# EAGLE design couch-int-rc (EAGLE 7.6.0)

## Sheet 1 of 4
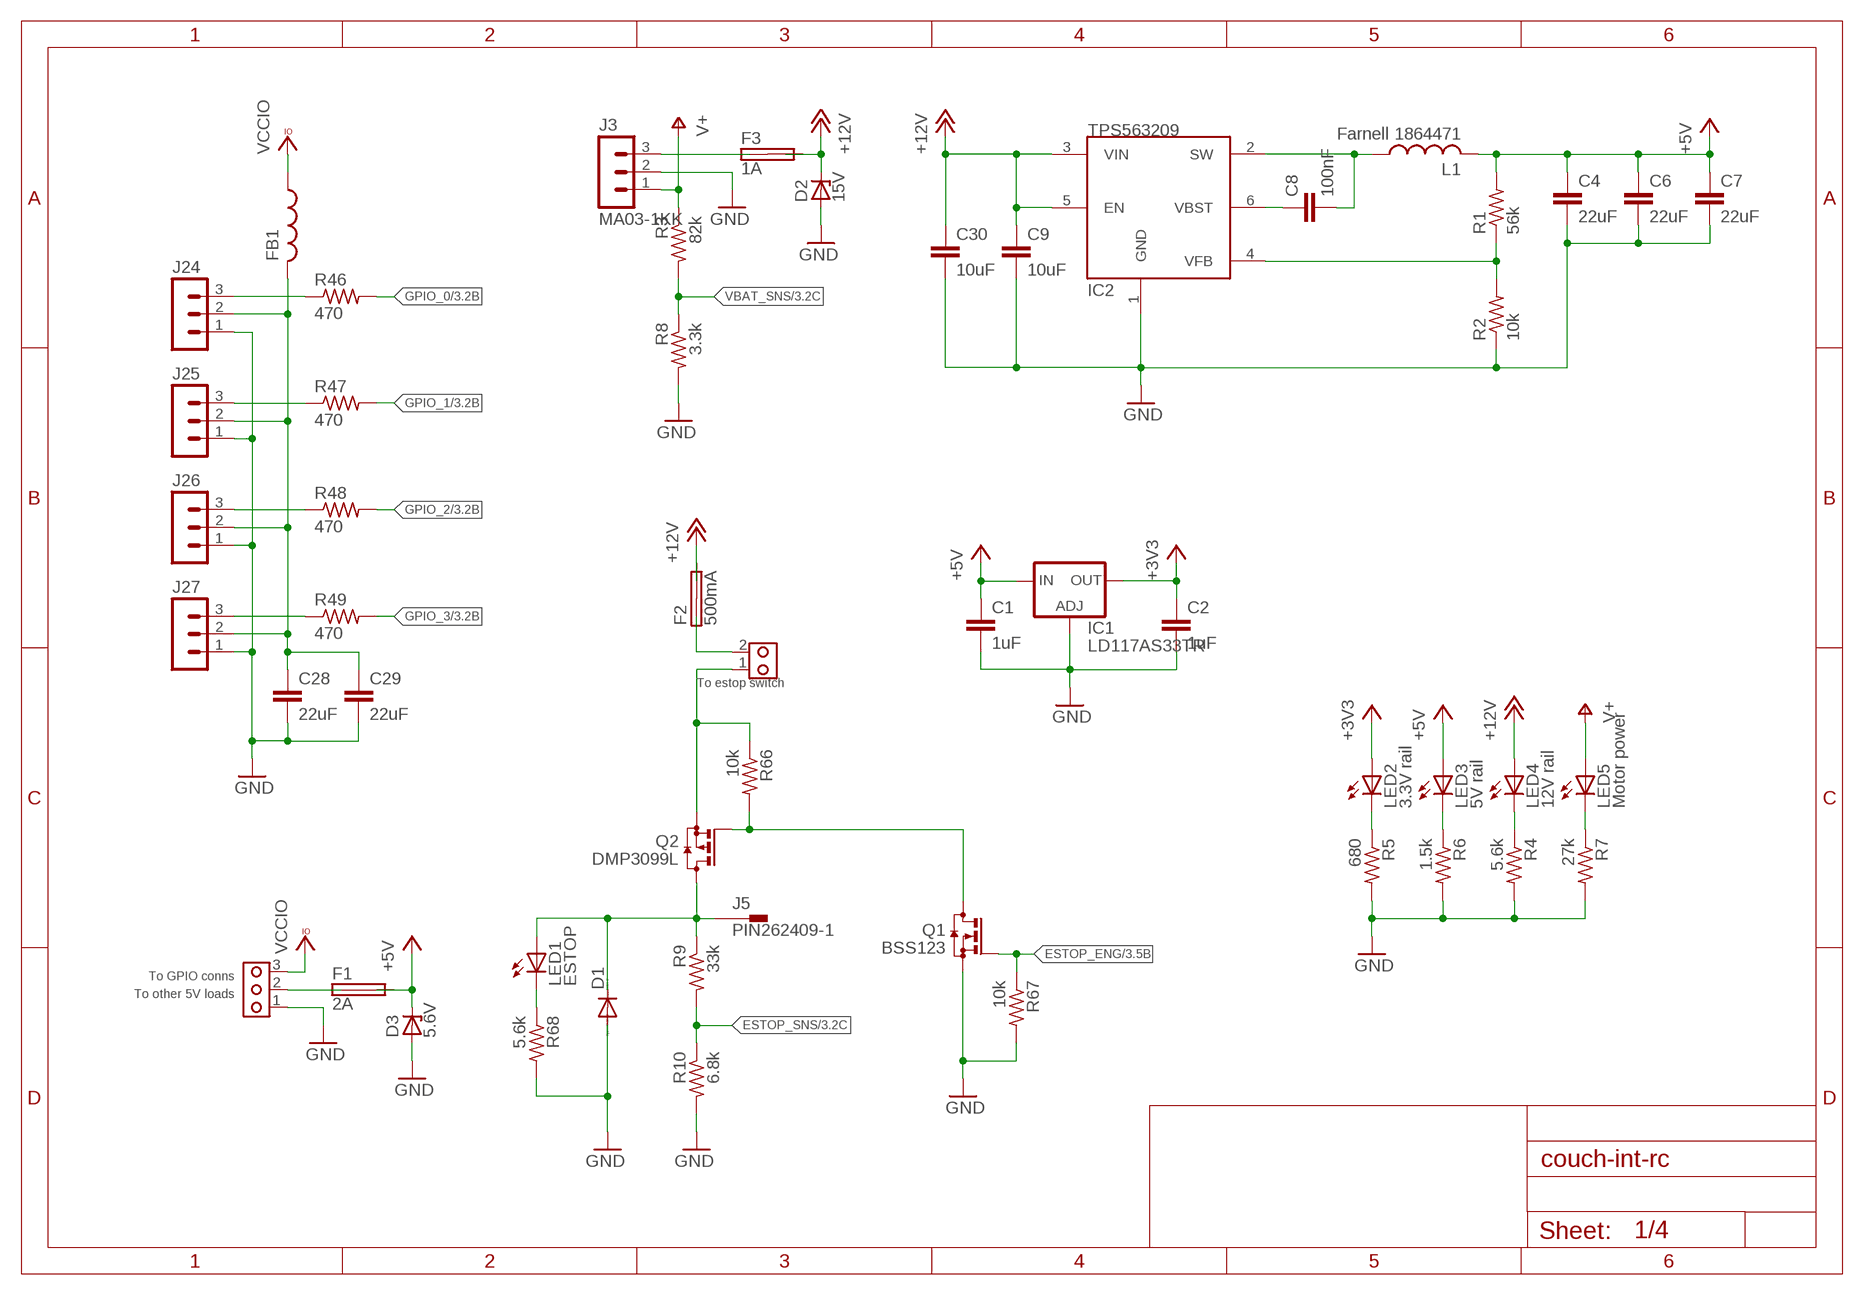
[diagram p0: schematic, sheet 1]

### Parts
C1  1uF  C-EUC0603  [C0603]
C2  1uF  C-EUC0603  [C0603]
C4  22uF  C-EUC1206  [C1206]
C6  22uF  C-EUC1206  [C1206]
C7  22uF  C-EUC1206  [C1206]
C8  100nF  C-EUC0603  [C0603]
C9  10uF  C-EUC1206  [C1206]
C28  22uF  C-EUC1206  [C1206]
C29  22uF  C-EUC1206  [C1206]
C30  10uF  C-EUC1206  [C1206]
D1  DIODE-SMB  [SMB]
D2  15V  ZENER-DIODESOD80C  [SOD80C]
D3  5.6V  ZENER-DIODESOD80C  [SOD80C]
F1  2A  FUSESHK20L  [SHK20L]
F2  500mA  SHK20L  [SHK20L]
F3  1A  SHK20L  [SHK20L]
FB1  L-USL3216C  [L3216C]
IC1  LD117AS33TR  [SOT223]
IC2  TPS563209  [SOT23-6]
J1  PCBTERM3  [PCBTERM3]
J3  MA03-1KK  [MOLEX-3]
J4  PCBTERM2  [PCBTERM]
J5  PIN262409-1  [62409-1]
J24  MA03-1  [MA03-1]
J25  MA03-1  [MA03-1]
J26  MA03-1  [MA03-1]
J27  MA03-1  [MA03-1]
L1  Farnell 1864471  L_USMCSDRH73B  [MCSDRH73B]
LED1  ESTOP  LEDCHIPLED_0603  [CHIPLED_0603]
LED2  3.3V rail  LEDCHIPLED_0603  [CHIPLED_0603]
LED3  5V rail  LEDCHIPLED_0603  [CHIPLED_0603]
LED4  12V rail  LEDCHIPLED_0603  [CHIPLED_0603]
LED5  Motor power  LEDCHIPLED_0603  [CHIPLED_0603]
Q1  BSS123  [SOT23]
Q2  DMP3099L  BSS84  [SOT23]
R1  56k  R-US_R0603  [R0603]
R2  10k  R-US_R0603  [R0603]
R3  82k  R-US_R0603  [R0603]
R4  5.6k  R-US_R0603  [R0603]
R5  680  R-US_R0603  [R0603]
R6  1.5k  R-US_R0603  [R0603]
R7  27k  R-US_R0603  [R0603]
R8  3.3k  R-US_R0603  [R0603]
R9  33k  R-US_R0603  [R0603]
R10  6.8k  R-US_R0603  [R0603]
R46  470  R-US_R0603  [R0603]
R47  470  R-US_R0603  [R0603]
R48  470  R-US_R0603  [R0603]
R49  470  R-US_R0603  [R0603]
R66  10k  R-US_R0603  [R0603]
R67  10k  R-US_R0603  [R0603]
R68  5.6k  R-US_R0603  [R0603]

### Nets
12V_ESTOP: D1.C J5.A1 J5.A2 LED1.A Q2.3(D) R9.1
+3V3: C2.1 IC1.4(OUT) LED2.A ; also sheet 2,3,4
+5V: C1.1 C4.1 C6.1 C7.1 D3.C F1.2A F1.2B IC1.3(IN) L1.P$2 LED3.A R1.2 ; also sheet 4
+12V: C9.1 C30.1 D2.C F2.2A F2.2B F3.2A F3.2B IC2.3(VIN) IC2.5(EN) LED4.A
ESTOP_ENG: Q1.1(G) R67.1 ; also sheet 3
ESTOP_SNS: R9.2 R10.1 ; also sheet 3
GND: C1.2 C2.2 C4.2 C6.2 C7.2 C9.2 C28.2 C29.2 C30.2 D1.A D2.A D3.A IC1.1(ADJ) IC2.1(GND) J1.1 J3.2 J24.1 J25.1 J26.1 J27.1 Q1.2(S) R2.1 R4.2 R5.2 R6.2 R7.2 R8.2 R10.2 R67.2 R68.2 ; also sheet 2,3,4
GPIO_0: R46.2 ; also sheet 3
GPIO_1: R47.2 ; also sheet 3
GPIO_2: R48.2 ; also sheet 3
GPIO_3: R49.2 ; also sheet 3
N$2: IC2.4(VFB) R1.1 R2.2
N$3: C8.2 IC2.2(SW) L1.P$1
N$4: F1.1A F1.1B J1.2
N$5: C8.1 IC2.6(VBST)
N$6: LED2.C R5.1
N$7: LED3.C R6.1
N$8: LED4.C R4.1
N$9: LED5.C R7.1
N$13: F3.1A F3.1B J3.3
N$45: F2.1A F2.1B J4.2
N$72: Q1.3(D) Q2.1(G) R66.2
N$73: C28.1 C29.1 FB1.2 J24.2 J25.2 J26.2 J27.2
N$74: J4.1 Q2.2(S) R66.1
N$75: LED1.C R68.1
N$76: J27.3 R49.1
N$77: J26.3 R48.1
N$78: J25.3 R47.1
N$79: J24.3 R46.1
V+: J3.1 LED5.A R3.1
VBAT_SNS: R3.2 R8.1 ; also sheet 3
VCCIO: FB1.1 J1.3

### Notes on the sheet
- To estop switch
- To GPIO conns
- To other 5V loads

## Sheet 2 of 4
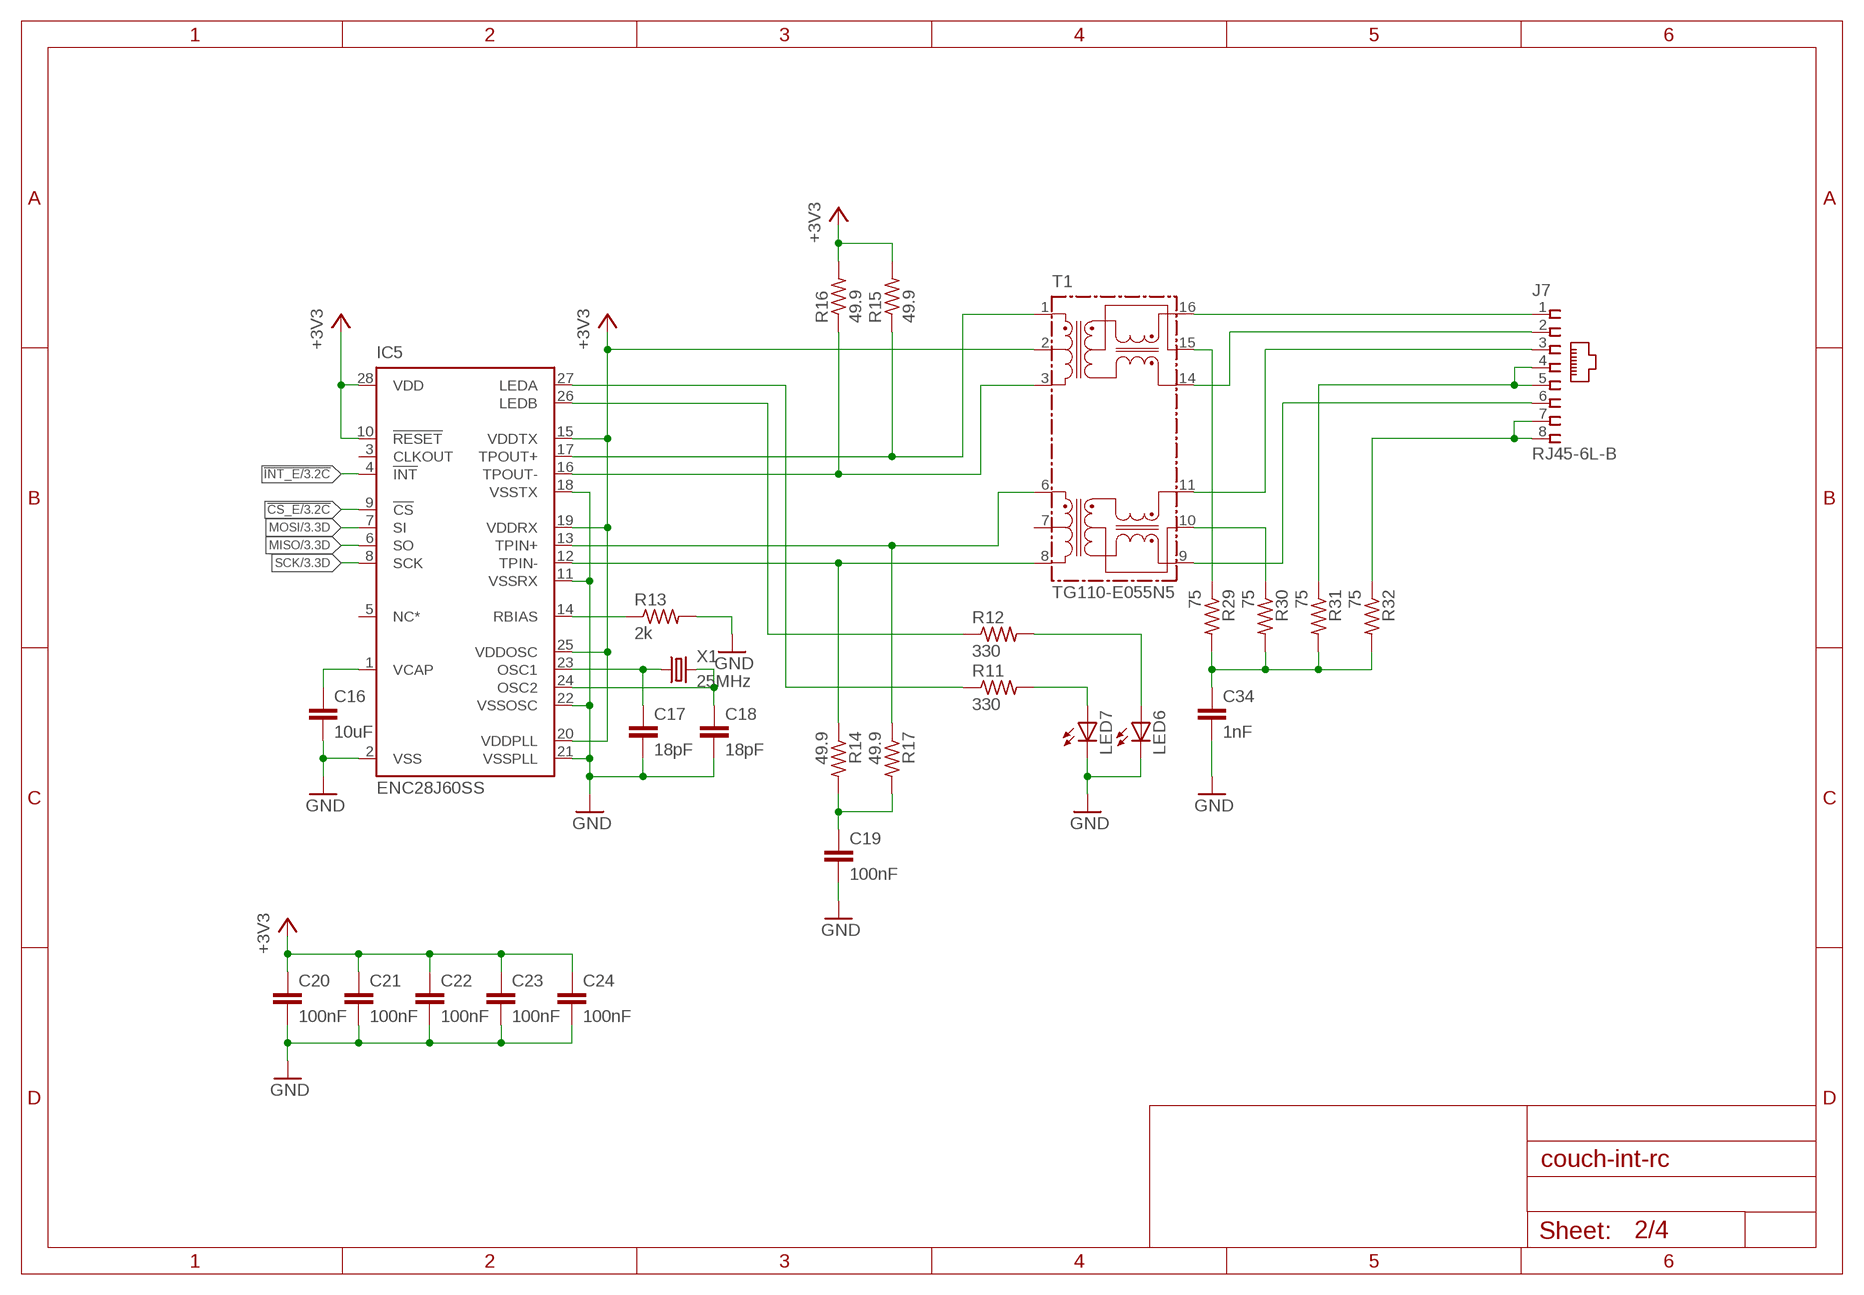
[diagram p1: schematic, sheet 2]

### Parts
C16  10uF  C-EUC0603  [C0603]
C17  18pF  C-EUC0603  [C0603]
C18  18pF  C-EUC0603  [C0603]
C19  100nF  C-EUC0603  [C0603]
C20  100nF  C-EUC0603  [C0603]
C21  100nF  C-EUC0603  [C0603]
C22  100nF  C-EUC0603  [C0603]
C23  100nF  C-EUC0603  [C0603]
C24  100nF  C-EUC0603  [C0603]
C34  1nF  C-EUC0603  [C0603]
IC5  ENC28J60SS  [SSOP-28]
J7  RJ45-6L-B  [RJ45-NO-SHIELD]
LED6  LEDCHIP-LED0603  [CHIP-LED0603]
LED7  LEDCHIP-LED0603  [CHIP-LED0603]
R11  330  R-US_R0603  [R0603]
R12  330  R-US_R0603  [R0603]
R13  2k  R-US_R0603  [R0603]
R14  49.9  R-US_R0603  [R0603]
R15  49.9  R-US_R0603  [R0603]
R16  49.9  R-US_R0603  [R0603]
R17  49.9  R-US_R0603  [R0603]
R29  75  R-US_R0603  [R0603]
R30  75  R-US_R0603  [R0603]
R31  75  R-US_R0603  [R0603]
R32  75  R-US_R0603  [R0603]
T1  TG110-E055N5  [N5]
X1  25MHz  CRYSTALHC49S  [HC49/S]

### Nets
!CS_E: IC5.9(!CS) ; also sheet 3
!INT_E: IC5.4(!INT) ; also sheet 3
+3V3: C20.1 C21.1 C22.1 C23.1 C24.1 IC5.10(!RESET) IC5.15(VDDTX) IC5.19(VDDRX) IC5.20(VDDPLL) IC5.25(VDDOSC) IC5.28(VDD) R15.2 R16.2 T1.2 ; also sheet 1,3,4
GND: C16.2 C17.2 C18.2 C19.2 C20.2 C21.2 C22.2 C23.2 C24.2 C34.2 IC5.2(VSS) IC5.11(VSSRX) IC5.18(VSSTX) IC5.21(VSSPLL) IC5.22(VSSOSC) LED6.C LED7.C R13.2 ; also sheet 1,3,4
MISO: IC5.6(SO) ; also sheet 3
MOSI: IC5.7(SI) ; also sheet 3
N$11: LED6.A R12.2
N$14: IC5.17(TPOUT+) R15.1 T1.1
N$15: IC5.16(TPOUT-) R16.1 T1.3
N$16: IC5.13(TPIN+) R17.1 T1.6
N$17: IC5.12(TPIN-) R14.1 T1.8
N$18: C16.1 IC5.1(VCAP)
N$19: IC5.27(LEDA) R11.1
N$20: IC5.26(LEDB) R12.1
N$21: J7.1 T1.16
N$22: J7.4 J7.5 R31.1
N$23: C18.1 IC5.24(OSC2) X1.2
N$24: C17.1 IC5.23(OSC1) X1.1
N$25: IC5.14(RBIAS) R13.1
N$28: LED7.A R11.2
N$29: J7.7 J7.8 R32.1
N$33: C19.1 R14.2 R17.2
N$34: J7.2 T1.14
N$35: J7.3 T1.11
N$36: J7.6 T1.9
N$38: R29.1 T1.15
N$39: C34.1 R29.2 R30.2 R31.2 R32.2
N$56: R30.1 T1.10
SCK: IC5.8(SCK) ; also sheet 3
Unconnected: IC5.3(CLKOUT) IC5.5(NC*) T1.7

## Sheet 3 of 4
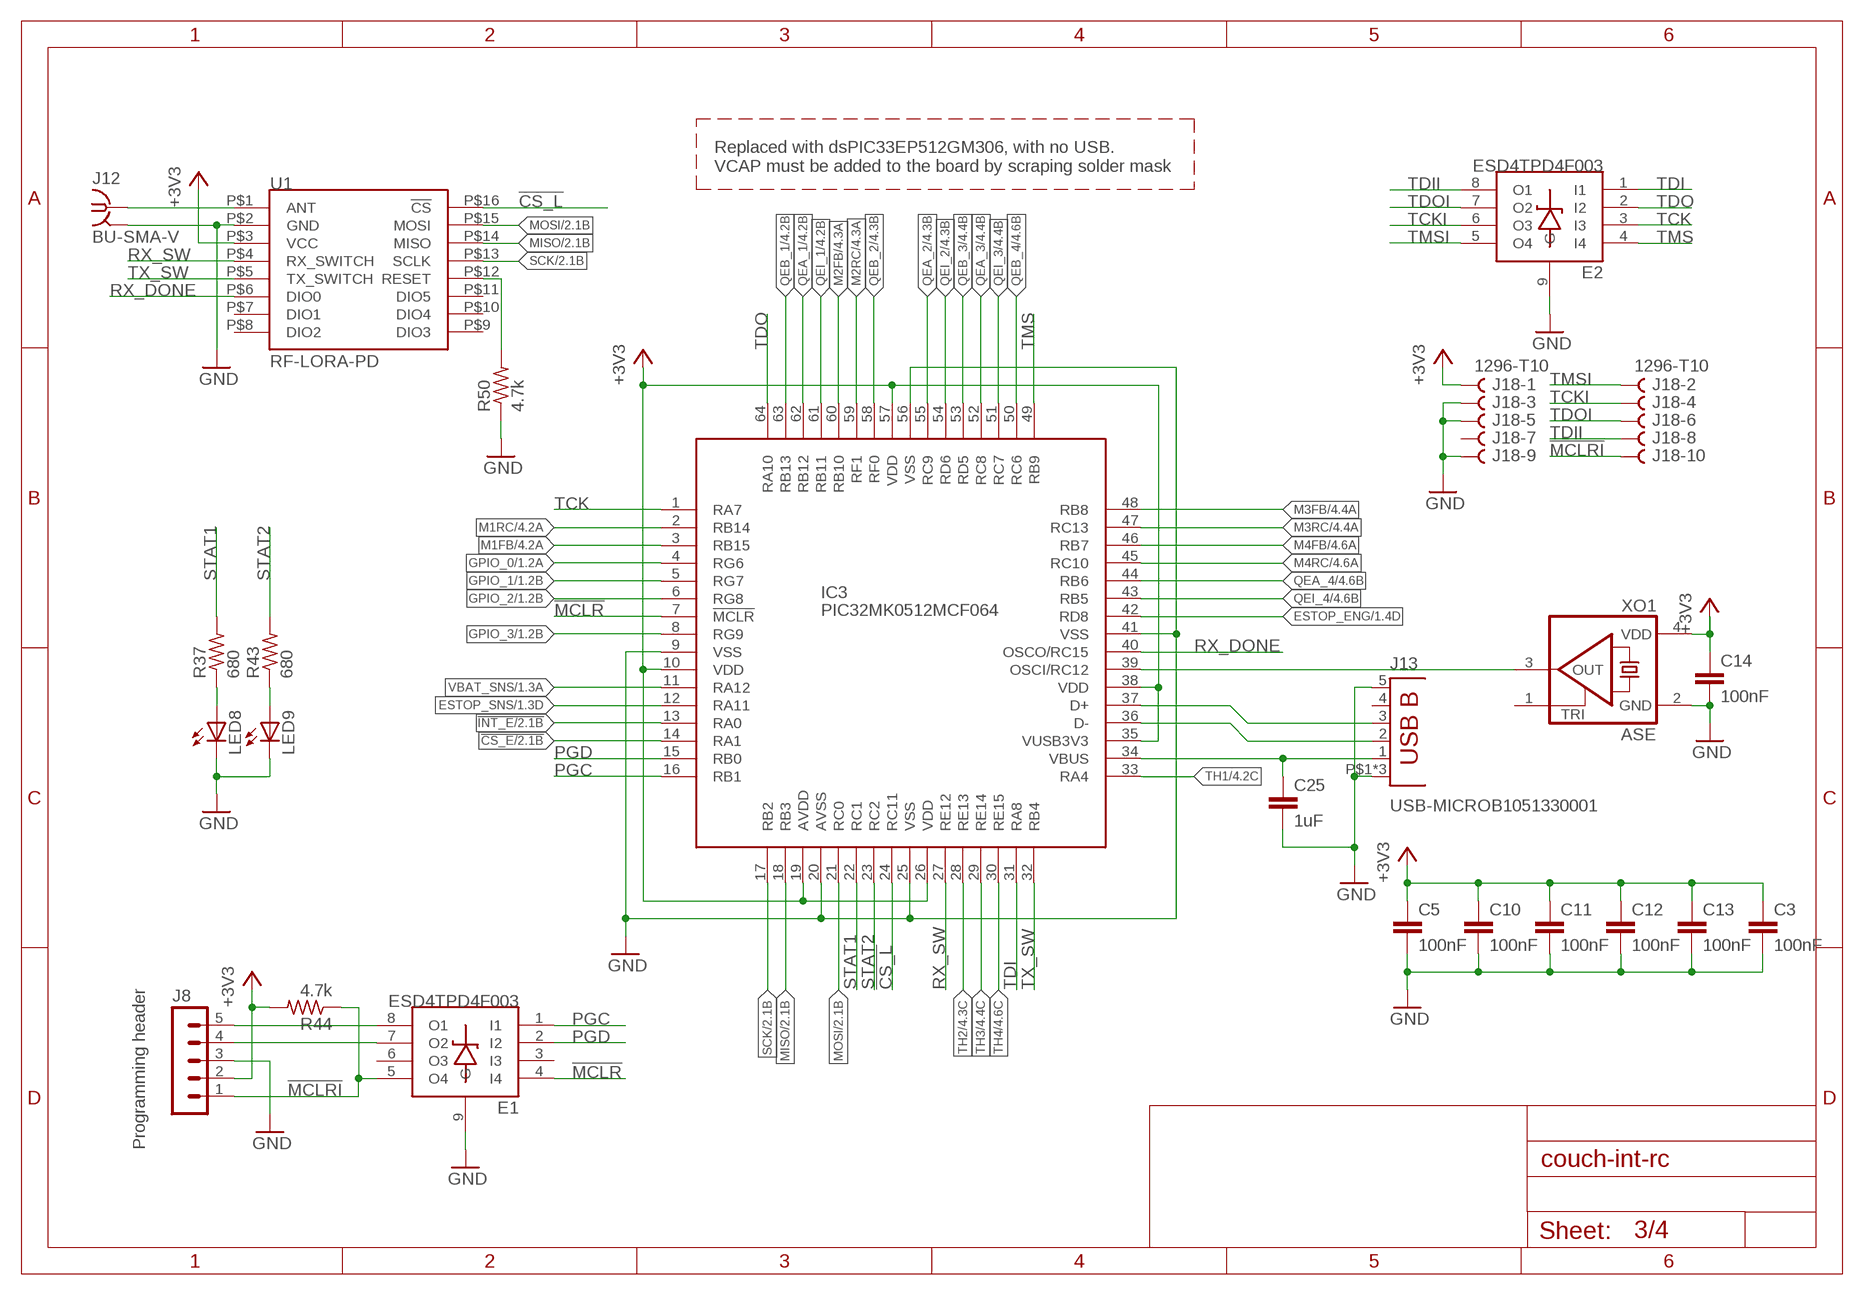
[diagram p2: schematic, sheet 3]

### Parts
C3  100nF  C-EUC0603  [C0603]
C5  100nF  C-EUC0603  [C0603]
C10  100nF  C-EUC0603  [C0603]
C11  100nF  C-EUC0603  [C0603]
C12  100nF  C-EUC0603  [C0603]
C13  100nF  C-EUC0603  [C0603]
C14  100nF  C-EUC0603  [C0603]
C25  1uF  C-EUC0603  [C0603]
E1  ESD4TPD4F003  [WSON-8]
E2  ESD4TPD4F003  [WSON-8]
IC3  PIC32MK0512MCF064  [TQFP-64-10]
J8  MA05-1  [MA05-1]
J12  BU-SMA-V  [BU-SMA-V]
J13  USB-MICROB1051330001  [1051330001]
J18  1296-T10  [1296-10]
LED8  LEDCHIP-LED0603  [CHIP-LED0603]
LED9  LEDCHIP-LED0603  [CHIP-LED0603]
R37  680  R-US_R0603  [R0603]
R43  680  R-US_R0603  [R0603]
R44  4.7k  R-US_R0603  [R0603]
R50  4.7k  R-US_R0603  [R0603]
U1  RF-LORA-PD  [RF-LORA-DIP]
XO1  ASE  [ASE]

### Nets
!CS_E: IC3.14(RA1) ; also sheet 2
!CS_L: IC3.24(RC11) U1.P$16(!CS)
!INT_E: IC3.13(RA0) ; also sheet 2
!MCLR: E1.4(I4) IC3.7(!MCLR)
!MCLRI: E1.5(O4) J8.1 J18.10 R44.1
+3V3: C3.1 C5.1 C10.1 C11.1 C12.1 C13.1 C14.1 IC3.10(VDD) IC3.19(AVDD) IC3.26(VDD) IC3.35(VUSB3V3) IC3.38(VDD) IC3.57(VDD) J8.2 J18.1 R44.2 U1.P$3(VCC) XO1.4(VDD) ; also sheet 1,2,4
ESTOP_ENG: IC3.42(RD8) ; also sheet 1
ESTOP_SNS: IC3.12(RA11) ; also sheet 1
GND: C3.2 C5.2 C10.2 C11.2 C12.2 C13.2 C14.2 C25.2 E1.9(G) E2.9(G) IC3.9(VSS) IC3.20(AVSS) IC3.25(VSS) IC3.41(VSS) IC3.56(VSS) J8.3 J12.2 J12.3 J12.4 J12.5 J13.5(GND) J13.P$1(SHIELD) J13.P$2(SHIELD) J13.P$3(SHIELD) J18.3 J18.5 J18.9 LED8.C LED9.C R50.1 U1.P$2(GND) XO1.2(GND) ; also sheet 1,2,4
GPIO_0: IC3.4(RG6) ; also sheet 1
GPIO_1: IC3.5(RG7) ; also sheet 1
GPIO_2: IC3.6(RG8) ; also sheet 1
GPIO_3: IC3.8(RG9) ; also sheet 1
M1FB: IC3.3(RB15) ; also sheet 4
M1RC: IC3.2(RB14) ; also sheet 4
M2FB: IC3.60(RB10) ; also sheet 4
M2RC: IC3.59(RF1) ; also sheet 4
M3FB: IC3.48(RB8) ; also sheet 4
M3RC: IC3.47(RC13) ; also sheet 4
M4FB: IC3.46(RB7) ; also sheet 4
M4RC: IC3.45(RC10) ; also sheet 4
MISO: IC3.18(RB3) U1.P$14(MISO) ; also sheet 2
MOSI: IC3.21(RC0) U1.P$15(MOSI) ; also sheet 2
N$43: IC3.39(OSCI/RC12) XO1.3(OUT)
N$46: E1.8(O1) J8.5
N$47: E1.7(O2) J8.4
N$48: C25.1 IC3.34(VBUS) J13.1(VBUS)
N$49: IC3.36(D-) J13.2(D-)
N$50: IC3.37(D+) J13.3(D+)
N$66: J12.1 U1.P$1(ANT)
N$67: R50.2 U1.P$12(RESET)
N$69: LED8.A R37.1
N$70: LED9.A R43.1
PGC: E1.1(I1) IC3.16(RB1)
PGD: E1.2(I2) IC3.15(RB0)
QEA_1: IC3.62(RB12) ; also sheet 4
QEA_2: IC3.55(RC9) ; also sheet 4
QEA_3: IC3.52(RC8) ; also sheet 4
QEA_4: IC3.44(RB6) ; also sheet 4
QEB_1: IC3.63(RB13) ; also sheet 4
QEB_2: IC3.58(RF0) ; also sheet 4
QEB_3: IC3.53(RD5) ; also sheet 4
QEB_4: IC3.50(RC6) ; also sheet 4
QEI_1: IC3.61(RB11) ; also sheet 4
QEI_2: IC3.54(RD6) ; also sheet 4
QEI_3: IC3.51(RC7) ; also sheet 4
QEI_4: IC3.43(RB5) ; also sheet 4
RX_DONE: IC3.40(OSCO/RC15) U1.P$6(DIO0)
RX_SW: IC3.27(RE12) U1.P$4(RX_SWITCH)
SCK: IC3.17(RB2) U1.P$13(SCLK) ; also sheet 2
STAT1: IC3.22(RC1) R37.2
STAT2: IC3.23(RC2) R43.2
TCK: E2.3(I3) IC3.1(RA7)
TCKI: E2.6(O3) J18.4
TDI: E2.1(I1) IC3.31(RA8)
TDII: E2.8(O1) J18.8
TDO: E2.2(I2) IC3.64(RA10)
TDOI: E2.7(O2) J18.6
TH1: IC3.33(RA4) ; also sheet 4
TH2: IC3.28(RE13) ; also sheet 4
TH3: IC3.29(RE14) ; also sheet 4
TH4: IC3.30(RE15) ; also sheet 4
TMS: E2.4(I4) IC3.49(RB9)
TMSI: E2.5(O4) J18.2
TX_SW: IC3.32(RB4) U1.P$5(TX_SWITCH)
VBAT_SNS: IC3.11(RA12) ; also sheet 1
Unconnected: E1.3(I3) E1.6(O3) J13.4(USBID) J18.7 U1.P$7(DIO1) U1.P$8(DIO2) U1.P$9(DIO3) U1.P$10(DIO4) U1.P$11(DIO5) XO1.1(TRI)

### Notes on the sheet
- Replaced with dsPIC33EP512GM306, with no USB.
  VCAP must be added to the board by scraping solder mask
- Programming header

## Sheet 4 of 4
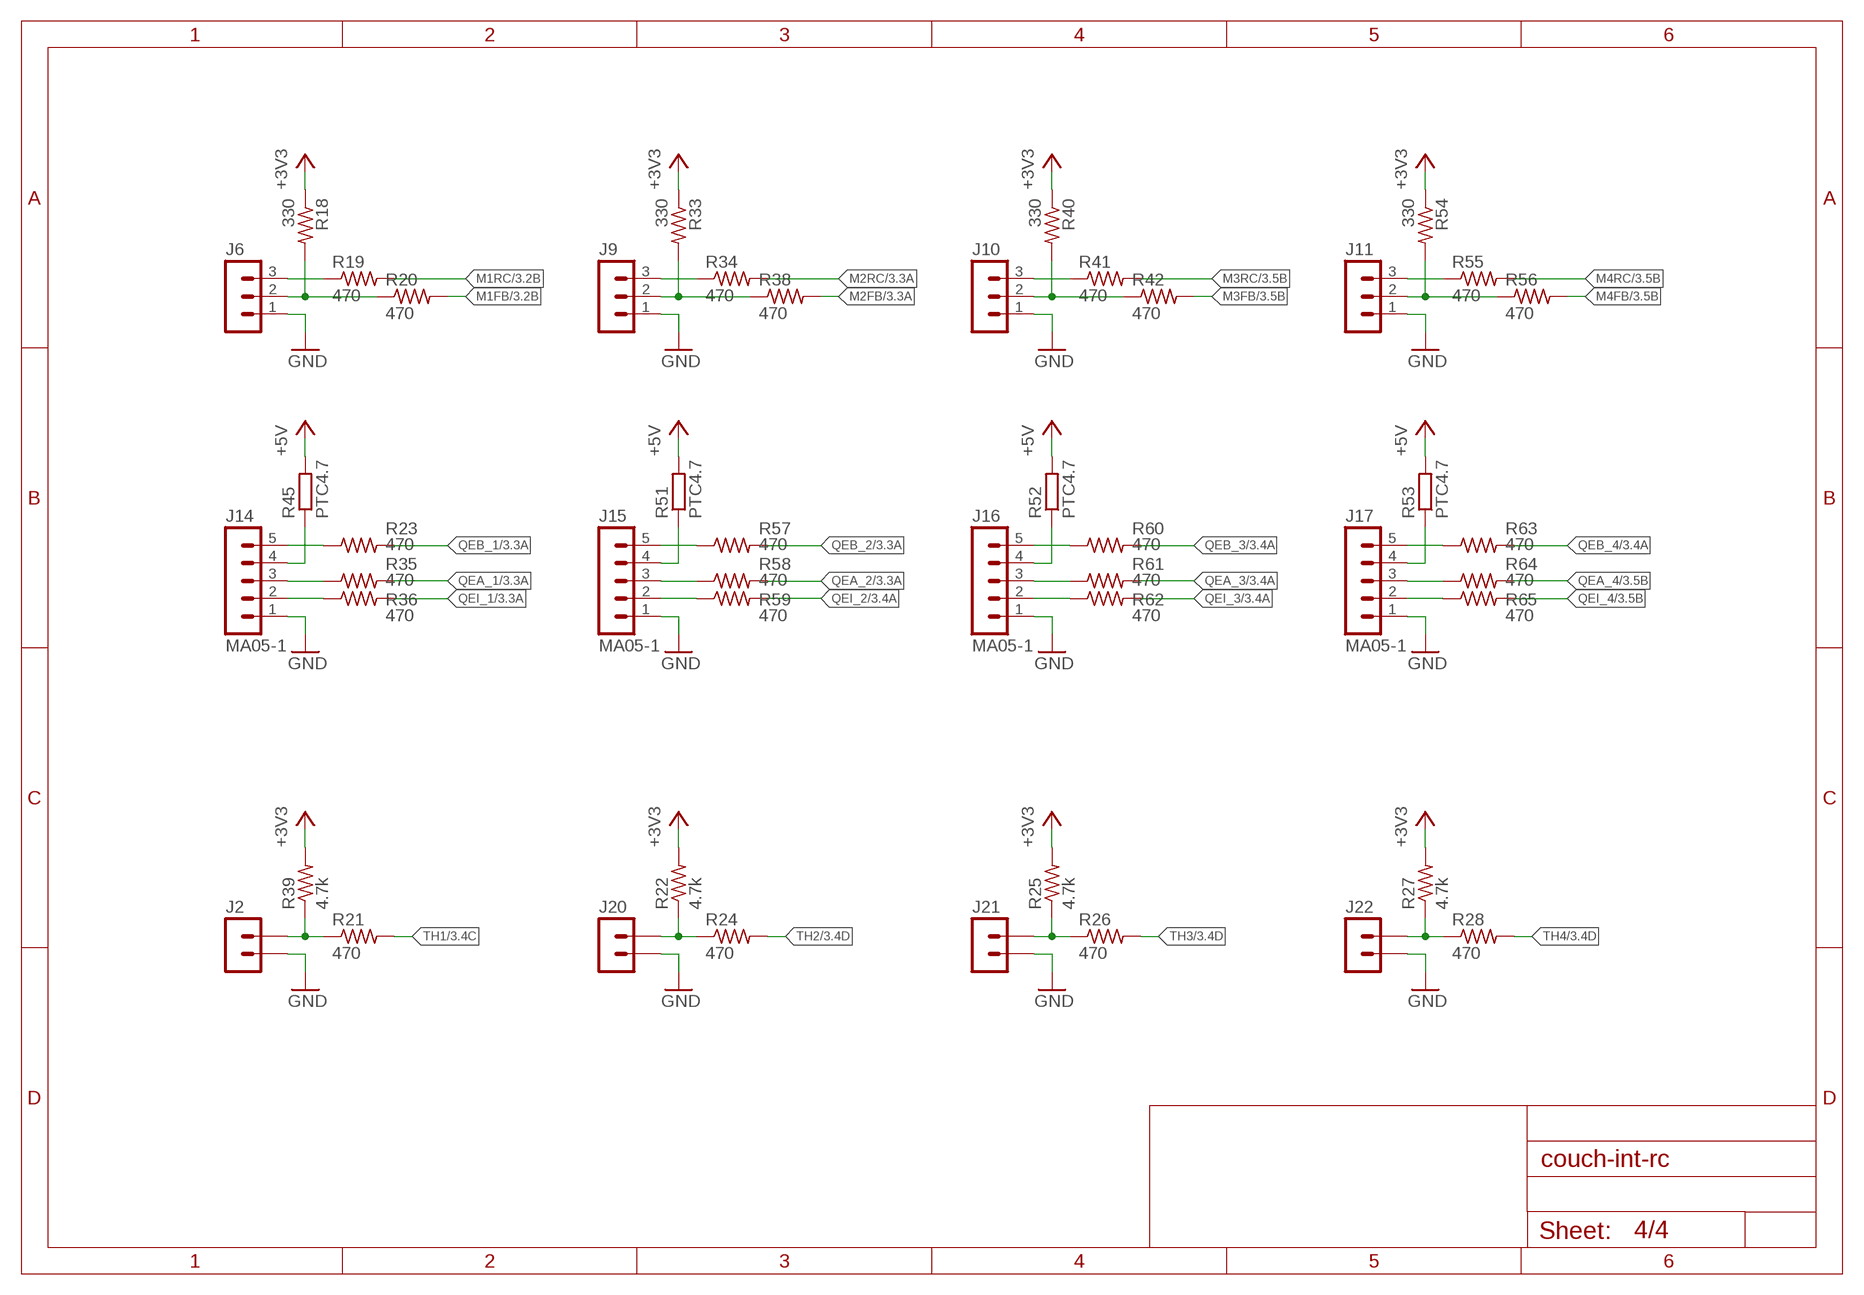
[diagram p3: schematic, sheet 4]

### Parts
J2  MA02-1  [MOLEX-2]
J6  MA03-1  [MA03-1]
J9  MA03-1  [MA03-1]
J10  MA03-1  [MA03-1]
J11  MA03-1  [MA03-1]
J14  MA05-1  [MOLEX-5]
J15  MA05-1  [MOLEX-5]
J16  MA05-1  [MOLEX-5]
J17  MA05-1  [MOLEX-5]
J20  MA02-1  [MOLEX-2]
J21  MA02-1  [MOLEX-2]
J22  MA02-1  [MOLEX-2]
R18  330  R-US_R0603  [R0603]
R19  470  R-US_R0603  [R0603]
R20  470  R-US_R0603  [R0603]
R21  470  R-US_R0603  [R0603]
R22  4.7k  R-US_R0603  [R0603]
R23  470  R-US_R0603  [R0603]
R24  470  R-US_R0603  [R0603]
R25  4.7k  R-US_R0603  [R0603]
R26  470  R-US_R0603  [R0603]
R27  4.7k  R-US_R0603  [R0603]
R28  470  R-US_R0603  [R0603]
R33  330  R-US_R0603  [R0603]
R34  470  R-US_R0603  [R0603]
R35  470  R-US_R0603  [R0603]
R36  470  R-US_R0603  [R0603]
R38  470  R-US_R0603  [R0603]
R39  4.7k  R-US_R0603  [R0603]
R40  330  R-US_R0603  [R0603]
R41  470  R-US_R0603  [R0603]
R42  470  R-US_R0603  [R0603]
R45  PTC4.7  R-EU_R0603  [R0603]
R51  PTC4.7  R-EU_R0603  [R0603]
R52  PTC4.7  R-EU_R0603  [R0603]
R53  PTC4.7  R-EU_R0603  [R0603]
R54  330  R-US_R0603  [R0603]
R55  470  R-US_R0603  [R0603]
R56  470  R-US_R0603  [R0603]
R57  470  R-US_R0603  [R0603]
R58  470  R-US_R0603  [R0603]
R59  470  R-US_R0603  [R0603]
R60  470  R-US_R0603  [R0603]
R61  470  R-US_R0603  [R0603]
R62  470  R-US_R0603  [R0603]
R63  470  R-US_R0603  [R0603]
R64  470  R-US_R0603  [R0603]
R65  470  R-US_R0603  [R0603]

### Nets
+3V3: R18.1 R22.2 R25.2 R27.2 R33.1 R39.2 R40.1 R54.1 ; also sheet 1,2,3
+5V: R45.2 R51.2 R52.2 R53.2 ; also sheet 1
GND: J2.1 J6.1 J9.1 J10.1 J11.1 J14.1 J15.1 J16.1 J17.1 J20.1 J21.1 J22.1 ; also sheet 1,2,3
M1FB: R20.2 ; also sheet 3
M1RC: R19.2 ; also sheet 3
M2FB: R38.2 ; also sheet 3
M2RC: R34.2 ; also sheet 3
M3FB: R42.2 ; also sheet 3
M3RC: R41.2 ; also sheet 3
M4FB: R56.2 ; also sheet 3
M4RC: R55.2 ; also sheet 3
N$1: J6.2 R18.2 R20.1
N$10: J6.3 R19.1
N$12: J20.2 R22.1 R24.1
N$26: J2.2 R21.1 R39.1
N$27: J21.2 R25.1 R26.1
N$30: J22.2 R27.1 R28.1
N$31: J9.2 R33.2 R38.1
N$32: J9.3 R34.1
N$37: J10.2 R40.2 R42.1
N$40: J10.3 R41.1
N$41: J11.2 R54.2 R56.1
N$42: J11.3 R55.1
N$51: J14.5 R23.1
N$52: J14.3 R35.1
N$53: J14.2 R36.1
N$54: J15.5 R57.1
N$55: J15.3 R58.1
N$57: J15.2 R59.1
N$58: J16.5 R60.1
N$59: J16.3 R61.1
N$60: J16.2 R62.1
N$61: J17.5 R63.1
N$62: J17.3 R64.1
N$63: J17.2 R65.1
N$64: J15.4 R51.1
N$65: J14.4 R45.1
N$68: J16.4 R52.1
N$71: J17.4 R53.1
QEA_1: R35.2 ; also sheet 3
QEA_2: R58.2 ; also sheet 3
QEA_3: R61.2 ; also sheet 3
QEA_4: R64.2 ; also sheet 3
QEB_1: R23.2 ; also sheet 3
QEB_2: R57.2 ; also sheet 3
QEB_3: R60.2 ; also sheet 3
QEB_4: R63.2 ; also sheet 3
QEI_1: R36.2 ; also sheet 3
QEI_2: R59.2 ; also sheet 3
QEI_3: R62.2 ; also sheet 3
QEI_4: R65.2 ; also sheet 3
TH1: R21.2 ; also sheet 3
TH2: R24.2 ; also sheet 3
TH3: R26.2 ; also sheet 3
TH4: R28.2 ; also sheet 3

## Library data of the parts
C1-C14 C16-C25 C28-C30 C34 = resistor:C-EU: CAPACITOR, European symbol
D1 = diode:DIODE-: DIODE
D2 D3 = diode:ZENER-DIODE: Z-Diode
E1 E2 = william:ESD4
F1 = fuse:FUSE: Fuse; OC_FARNELL: unknown; OC_NEWARK: unknown
F2 F3 = fuse:SHK20L: FUSE HOLDER 5 x 20 mm, SH contact, SHH1 Schukat, E1073 Buerklin; OC_FARNELL: unknown; OC_NEWARK: unknown
FB1 = resistor:L-US: INDUCTOR, American symbol
IC1 = v-reg:LD117A?*: Low drop fixed and adjustable positive voltage regulators 1 A Source: http://www.st.com/stonline/products/literature/ds/7194/ld1117axx.pdf
IC2 = william:TPS56*209
IC3 = william:PIC32MK*MCF064
IC5 = william:ENC28J60
J1 = william:PCBTERM3
J2 J20-J22 = william:MA02-1
J3 = william:MA03-1
J4 = william:PCBTERM2
J5 = con-faston:PIN2: Flachstecker Typ Tyco/Electronics/AMP TAB, FASTON Printed Circuit Board Tabs Source: http://www.buerklin.com, http://catalog.tycoelectronics.com; OC_FARNELL: unknown; OC_NEWARK: unknown
J6 J9-J11 J24-J27 = con-lstb:MA03-1: PIN HEADER; OC_FARNELL: unknown; OC_NEWARK: unknown
J7 = con-tycoelectronics:RJ45: CORCOM Modular RJ Jacks No Shield Source: www.tycoelectronics.com .. ENG_DS_1654001_1099_RJ_L_0507.pdf; MPN: RJ45-6L-B; OC_FARNELL: unknown; OC_NEWARK: 16R6090
J8 = con-lstb:MA05-1: PIN HEADER; OC_FARNELL: unknown; OC_NEWARK: unknown
J12 = con-coax:BU-SMA-V: FEMALE SMA CONNECTOR Radiall distributor RS 112-3794; OC_FARNELL: unknown; OC_NEWARK: unknown
J13 = william:USB-MICROB
J14-J17 = william:MA05-1
J18 = con-leotronics:1296-T10: 1.27mm SINGLE ROW FEMALE SOCKET Source: http://www.leotronics.co.uk/Conexcon/Data%20Sheets/sec.%20A/1296ing.pdf; OC_FARNELL: unknown; OC_NEWARK: unknown
L1 = william:L_US
LED1-LED9 = led:LED: LED OSRAM: - CHIPLED LG R971, LG N971, LY N971, LG Q971, LY Q971, LO R971, LY R971 LH N974, LH R974 LS Q976, LO Q976, LY Q976 LO Q996 - Hyper CHIPLED LW Q18S LB Q993, LB Q99A, LB R99A - SideLED LS A670, LO A670, LY A670, LG A670, LP A670 LB A673, LV A673, LT A673, LW A673 LH A674 LY A675 LS A676, LA A676, LO A676, LY A676, LW A676 LS A679, LY A679, LG A679 - Hyper Micro SIDELED® LS Y876, LA Y876, LO Y876, LY Y876 LT Y87S - SmartLED LW L88C, LW L88S LB L89C, LB L89S, LG L890 LS L89K, LO L89K, LY L89K LS L896, LA L896, LO L896, LY L896 - TOPLED LS T670, LO T670, LY T670, LG T670, LP T670 LSG T670, LSP T670, LSY T670, LOP T670, LYG T670 LG T671, LOG T671, LSG T671 LB T673, LV T673, LT T673, LW T673 LH T674 LS T676, LA T676, LO T676, LY T676, LB T676, LH T676, LSB T676, LW T676 LB T67C, LV T67C, LT T67C, LS T67K, LO T67K, LY T67K, LW E67C LS E67B, LA E67B, LO E67B, LY E67B, LB E67C, LV E67C, LT E67C LW T67C LS T679, LY T679, LG T679 LS T770, LO T770, LY T770, LG T770, LP T770 LB T773, LV T773, LT T773, LW T773 LH T774 LS E675, LA E675, LY E675, LS T675 LS T776, LA T776, LO T776, LY T776, LB T776 LHGB T686 LT T68C, LB T68C - Hyper Mini TOPLED® LB M676 - Mini TOPLED Santana® LG M470 LS M47K, LO M47K, LY M47K Source: http://www.osram.convergy.de LUXEON: - LUMILED® LXK2-PW12-R00, LXK2-PW12-S00, LXK2-PW14-U00, LXK2-PW14-V00 LXK2-PM12-R00, LXK2-PM12-S00, LXK2-PM14-U00 LXK2-PE12-Q00, LXK2-PE12-R00, LXK2-PE12-S00, LXK2-PE14-T00, LXK2-PE14-U00 LXK2-PB12-K00, LXK2-PB12-L00, LXK2-PB12-M00, LXK2-PB14-N00, LXK2-PB14-P00, LXK2-PB14-Q00 LXK2-PR12-L00, LXK2-PR12-M00, LXK2-PR14-Q00, LXK2-PR14-R00 LXK2-PD12-Q00, LXK2-PD12-R00, LXK2-PD12-S00 LXK2-PH12-R00, LXK2-PH12-S00 LXK2-PL12-P00, LXK2-PL12-Q00, LXK2-PL12-R00 Source: www.luxeon.com KINGBRIGHT: KA-3528ASYC Source: www.kingbright.com
Q1 = transistor-small-signal:BSS123: N-CHANNEL MOS FET
Q2 = transistor-small-signal:BSS84: P-CHANNEL MOS FET
R1-R44 R46-R50 R54-R68 = resistor:R-US_: RESISTOR, American symbol
R45 R51-R53 = resistor:R-EU_: RESISTOR, European symbol
T1 = halo-electronics:TG110-E*N5: E-Ultra (TM) 10/100BASE-TX SOIC-16 Fast Ethernet Magnetic Modules Source: www.haloelectronics.com .. e-ultra.pdf
U1 = william:RF-LORA-*
X1 = crystal:CRYSTAL: CRYSTAL; OC_FARNELL: 1667008; OC_NEWARK: unknown
XO1 = crystal:ASE: 3.3Vdc CMOS SMD CRYSTAL CLOCK OSCILLATOR SOurce: www.abracon.com; OC_FARNELL: unknown; OC_NEWARK: unknown

## Board
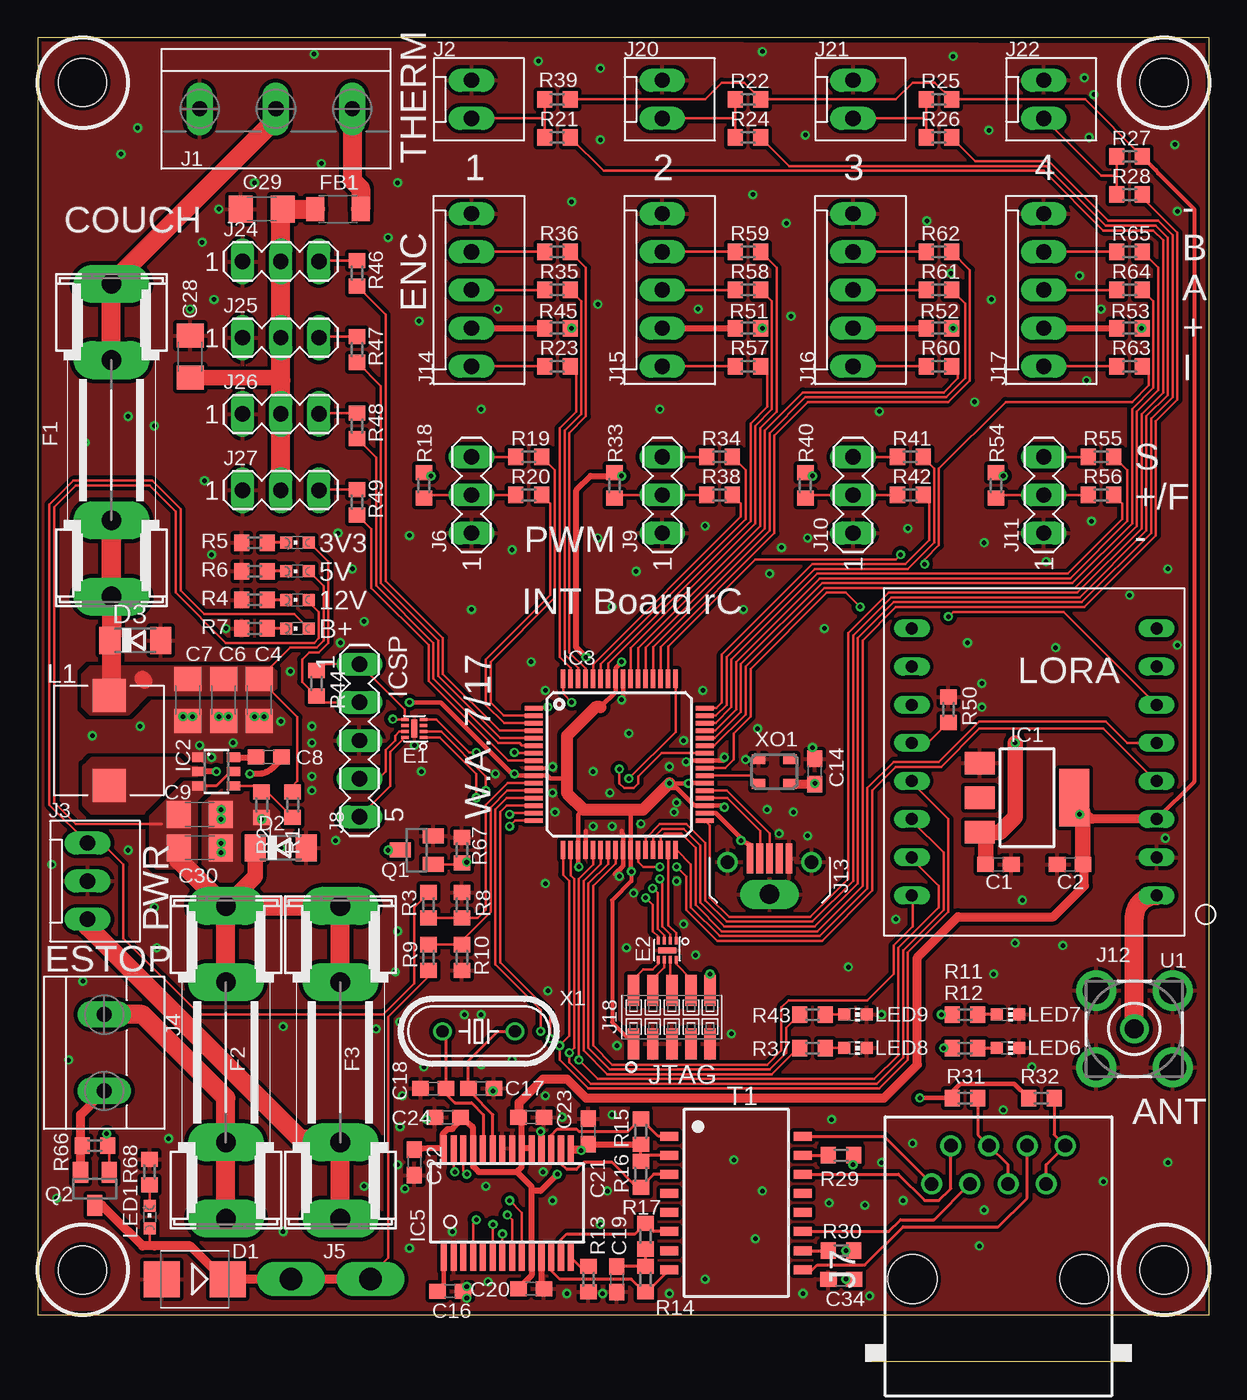
[diagram p4: board, top side]
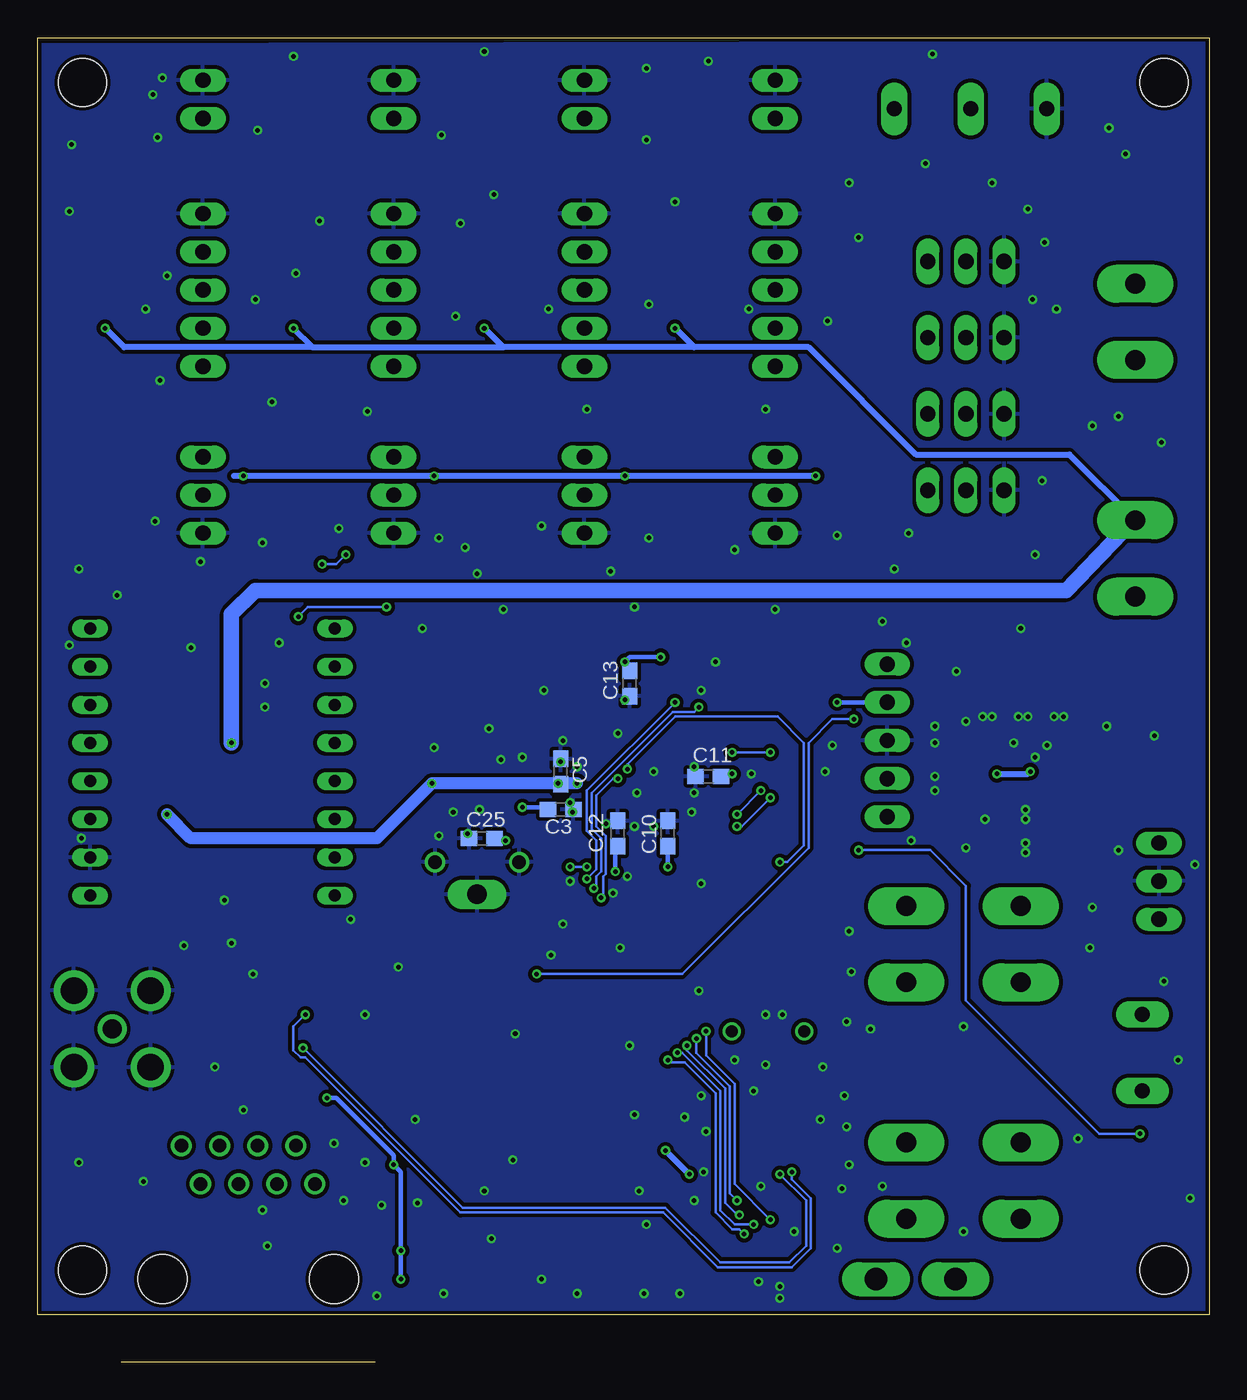
[diagram p5: board, bottom side, seen from below]

Size 78 x 85.08 mm. Coordinates in mm from the lower left corner, seen from the top.
Outline: 0,0 78,0 78,85.08 0,85.08 0,0
Copper layers (1*16): Top 0.035mm / dielectric 1.5mm / Bottom 0.035mm
Design rules "default *": minimum track width 6mil, minimum drill 0.25mm, track to track 6mil, track to pad 6mil, pad to pad 6mil, via to via 6mil, smd to smd 0mil, copper to edge 10mil, drill to drill 8mil, minimum pad ring 6mil, minimum via ring 6mil, stop-mask expansion 4mil, vias tented up to drill 13mil, thermal gap 10mil
Holes 3.2 mm at 3,3 75,3 3,82.08 75,82.08

### Footprints (pad centres in the part's own frame; a part is rotated, then mirrored left to right if it is on the bottom)
C0603 = smd 1.1 x 1: 1 -0.85,0; 2 0.85,0
C1206 = smd 1.6 x 1.8: 1 -1.4,0; 2 1.4,0
SMB = smd 2.4 x 2.4: A 2.2,0; C -2.2,0
SOD80C = smd 1.4 x 1.8: A 1.7,0; C -1.7,0
WSON-8 = smd 0.2 x 0.5: 1 -0.6,-0.625; 2 -0.2,-0.625; 3 0.2,-0.625; 4 0.6,-0.625; 5 0.6,0.625; 6 0.2,0.625; 7 -0.2,0.625; 8 -0.6,0.625 | smd 1.2 x 0.4: 9 0,0
SHK20L = drill 1.321 pad 2.54 long: 1A -10.414,0; 1B -5.334,0; 2A 10.414,0; 2B 5.334,0
L3216C = smd 1.2 x 1.6: 1 -1.5,0; 2 1.5,0
SOT223 = smd 1.5 x 2: 1 -2.3,-3.15; 2 0,-3.15; 3 2.3,-3.15 | smd 3.8 x 2: 4 0,3.15
SOT23-6 = smd 0.6 x 0.9: 1 -0.95,-1.15; 2 0,-1.15; 3 0.95,-1.15; 4 0.95,1.15; 5 0,1.15; 6 -0.95,1.15
TQFP-64-10 = smd 1.2 x 0.3: 1 -5.7,3.75; 2 -5.7,3.25; 3 -5.7,2.75; 4 -5.7,2.25; 5 -5.7,1.75; 6 -5.7,1.25; 7 -5.7,0.75; 8 -5.7,0.25; 9 -5.7,-0.25; 10 -5.7,-0.75; 11 -5.7,-1.25; 12 -5.7,-1.75; 13 -5.7,-2.25; 14 -5.7,-2.75; 15 -5.7,-3.25; 16 -5.7,-3.75; 33 5.7,-3.75; 34 5.7,-3.25; 35 5.7,-2.75; 36 5.7,-2.25; 37 5.7,-1.75; 38 5.7,-1.25; 39 5.7,-0.75; 40 5.7,-0.25; 41 5.7,0.25; 42 5.7,0.75; 43 5.7,1.25; 44 5.7,1.75; 45 5.7,2.25; 46 5.7,2.75; 47 5.7,3.25; 48 5.7,3.75 | smd 0.3 x 1.2: 17 -3.75,-5.7; 18 -3.25,-5.7; 19 -2.75,-5.7; 20 -2.25,-5.7; 21 -1.75,-5.7; 22 -1.25,-5.7; 23 -0.75,-5.7; 24 -0.25,-5.7; 25 0.25,-5.7; 26 0.75,-5.7; 27 1.25,-5.7; 28 1.75,-5.7; 29 2.25,-5.7; 30 2.75,-5.7; 31 3.25,-5.7; 32 3.75,-5.7; 49 3.75,5.7; 50 3.25,5.7; 51 2.75,5.7; 52 2.25,5.7; 53 1.75,5.7; 54 1.25,5.7; 55 0.75,5.7; 56 0.25,5.7; 57 -0.25,5.7; 58 -0.75,5.7; 59 -1.25,5.7; 60 -1.75,5.7; 61 -2.25,5.7; 62 -2.75,5.7; 63 -3.25,5.7; 64 -3.75,5.7
SSOP-28 = smd 0.406 x 1.778: 1 -4.225,-3.625; 2 -3.575,-3.625; 3 -2.925,-3.625; 4 -2.275,-3.625; 5 -1.625,-3.625; 6 -0.975,-3.625; 7 -0.325,-3.625; 8 0.325,-3.625; 9 0.975,-3.625; 10 1.625,-3.625; 11 2.275,-3.625; 12 2.925,-3.625; 13 3.575,-3.625; 14 4.225,-3.625; 15 4.225,3.625; 16 3.575,3.625; 17 2.925,3.625; 18 2.275,3.625; 19 1.625,3.625; 20 0.975,3.625; 21 0.325,3.625; 22 -0.325,3.625; 23 -0.975,3.625; 24 -1.625,3.625; 25 -2.275,3.625; 26 -2.925,3.625; 27 -3.575,3.625; 28 -4.225,3.625
PCBTERM3 = drill 1 pad 1.778 long: 1 -5.08,0; 2 0,0; 3 5.08,0
MOLEX-2 = drill 1.016 long: 1 3.81,0; 2 1.27,0
MOLEX-3 = drill 1.016 long: 1 2.54,0; 2 0,0; 3 -2.54,0
PCBTERM = drill 1 pad 1.778 long: 1 -2.54,0; 2 2.54,0
62409-1 = drill 1.5 pad 1.9 long: A1 -2.65,0; A2 2.65,0
MA03-1 = drill 1.016 long: 1 -2.54,0; 2 0,0; 3 2.54,0
RJ45-NO-SHIELD = drill 0.9 pad 1.4: 1 -4.445,6.35; 2 -3.175,8.89; 3 -1.905,6.35; 4 -0.635,8.89; 5 0.635,6.35; 6 1.905,8.89; 7 3.175,6.35; 8 4.445,8.89 | hole 3.251: -5.715,0; 5.715,0
MA05-1 = drill 1.016 long: 1 -5.08,0; 2 -2.54,0; 3 0,0; 4 2.54,0; 5 5.08,0
BU-SMA-V = drill 1.27: 1 0,0 | drill 1.778: 2 -2.55,2.55; 3 2.55,2.55; 4 2.55,-2.55; 5 -2.55,-2.55
1051330001 = smd 0.45 x 2: 1 -1.3,0.25; 2 -0.65,0.25; 3 0,0.25; 4 0.65,0.25; 5 1.3,0.25 | drill 1.3 long: P$1 0,-2.15 | drill 0.9: P$2 -2.8,0; P$3 2.8,0
MOLEX-5 = drill 1.016 long: 1 5.08,0; 2 2.54,0; 3 0,0; 4 -2.54,0; 5 -5.08,0
1296-10 = smd 0.76 x 2.05: 1 -2.54,-1.78; 2 -2.54,1.78; 3 -1.27,-1.78; 4 -1.27,1.78; 5 0,-1.78; 6 0,1.78; 7 1.27,-1.78; 8 1.27,1.78; 9 2.54,-1.78; 10 2.54,1.78
MCSDRH73B = smd 2.2 x 2.2: P$1 -3,0; P$2 3,0
CHIPLED_0603 = smd 0.8 x 0.8: A 0,-0.75; C 0,0.75
CHIP-LED0603 = smd 0.8 x 0.8: A 0,-0.75; C 0,0.75
SOT23 = smd 1 x 1.4: 1 -0.95,-1.1; 2 0.95,-1.1; 3 0,1.1
R0603 = smd 1 x 1.1: 1 -0.85,0; 2 0.85,0
N5 = smd 0.6 x 1.2: 1 -4.445,-4.445; 2 -3.175,-4.445; 3 -1.905,-4.445; 4 -0.635,-4.445; 5 0.635,-4.445; 6 1.905,-4.445; 7 3.175,-4.445; 8 4.445,-4.445; 9 4.445,4.445; 10 3.175,4.445; 11 1.905,4.445; 12 0.635,4.445; 13 -0.635,4.445; 14 -1.905,4.445; 15 -3.175,4.445; 16 -4.445,4.445
RF-LORA-DIP = drill 0.8 long: P$1 -8.15,8.89; P$2 -8.15,6.35; P$3 -8.15,3.81; P$4 -8.15,1.27; P$5 -8.15,-1.27; P$6 -8.15,-3.81; P$7 -8.15,-6.35; P$8 -8.15,-8.89; P$9 8.15,-8.89; P$10 8.15,-6.35; P$11 8.15,-3.81; P$12 8.15,-1.27; P$13 8.15,1.27; P$14 8.15,3.81; P$15 8.15,6.35; P$16 8.15,8.89
HC49/S = drill 0.813: 1 -2.413,0; 2 2.413,0
ASE = smd 0.9 x 0.65: 1 -1.05,-0.825; 2 1.05,-0.825; 3 1.05,0.825; 4 -1.05,0.825

### Placement (x,y rotation side)
C1  63.98,30 0 top
C2  68.74,30 180 top
C3  43.18,33.66 0 bottom
C4  14.76,40.96 270 top
C5  43.18,36.2 90 bottom
C6  12.38,40.96 270 top
C7  10,40.96 270 top
C8  15.4,37.15 0 top
C9  10.79,33.34 0 top
C10  36.04,32.07 90 bottom
C11  33.34,35.88 180 bottom
C12  39.37,32.07 90 bottom
C13  38.58,42.07 270 bottom
C14  51.75,36.2 90 top
C16  27.46,1.59 0 top
C17  29.53,15.08 0 top
C18  26.35,15.08 180 top
C19  38.58,2.38 270 top
C20  32.86,1.75 0 top
C21  36.67,12.22 90 top
C22  25.08,10.16 270 top
C23  32.86,13.18 0 top
C24  27.3,13.18 180 top
C25  48.42,31.75 180 bottom
C28  10.16,63.82 90 top
C29  14.92,73.66 180 top
C30  10.79,31.11 0 top
C34  53.5,2.38 180 top
D1  10.48,2.38 180 top
D2  16.19,31.11 0 top
D3  6.51,44.93 0 top
E1  25.08,39.05 90 top
E2  41.91,24.29 180 top
F1  4.92,58.26 270 top
F2  12.54,16.83 90 top
F3  20.16,16.83 90 top
FB1  20,73.66 180 top
IC1  65.88,34.45 270 top
IC2  11.91,36.2 270 top
IC3  38.73,36.67 0 top
IC5  31.27,7.46 0 top
J1  15.88,80.33 0 top
J2  28.89,78.42 90 top
J3  3.33,28.89 90 top
J4  4.45,17.46 90 top
J5  19.53,2.38 180 top
J6  28.89,54.61 90 top
J7  63.98,2.38 0 top
J8  21.43,38.26 270 top
J9  41.59,54.61 90 top
J10  54.29,54.61 90 top
J11  66.99,54.61 90 top
J12  73.03,19.05 0 top
J13  48.74,30.16 0 top
J14  28.89,68.26 90 top
J15  41.59,68.26 90 top
J16  54.29,68.26 90 top
J17  66.99,68.26 90 top
J18  42.23,19.84 0 top
J20  41.59,78.42 90 top
J21  54.29,78.42 90 top
J22  66.99,78.42 90 top
J24  16.19,70.17 0 top
J25  16.19,65.09 0 top
J26  16.19,60.01 0 top
J27  16.19,54.93 0 top
L1  4.76,38.26 90 top
LED1  7.46,6.51 0 top
LED2  17.3,51.44 90 top
LED3  17.3,49.53 90 top
LED4  17.3,47.62 90 top
LED5  17.3,45.72 90 top
LED6  64.61,17.78 270 top
LED7  64.61,20 270 top
LED8  54.45,17.78 270 top
LED9  54.45,20 270 top
Q1  25.24,30.96 90 top
Q2  3.81,8.41 180 top
R1  16.99,33.97 90 top
R2  14.92,33.97 90 top
R3  26.04,27.3 270 top
R4  14.45,47.62 180 top
R5  14.45,51.44 180 top
R6  14.45,49.53 180 top
R7  14.45,45.72 180 top
R8  28.26,27.3 90 top
R9  26.04,23.81 90 top
R10  28.26,23.81 270 top
R11  61.75,20 0 top
R12  61.75,17.78 0 top
R13  36.67,2.38 270 top
R14  40.48,2.38 90 top
R15  40.16,12.22 270 top
R16  40.16,9.37 90 top
R17  40.48,5.24 270 top
R18  25.72,55.24 270 top
R19  32.7,57.15 0 top
R20  32.7,54.61 0 top
R21  34.61,78.42 0 top
R22  47.31,80.96 0 top
R23  34.61,63.18 0 top
R24  47.31,78.42 0 top
R25  60.01,80.96 0 top
R26  60.01,78.42 0 top
R27  72.71,77.15 0 top
R28  72.71,74.61 0 top
R29  53.5,10.64 0 top
R30  53.5,4.29 0 top
R31  61.75,14.45 180 top
R32  66.83,14.45 180 top
R33  38.42,55.24 270 top
R34  45.4,57.15 0 top
R35  34.61,68.26 0 top
R36  34.61,70.8 0 top
R37  51.59,17.78 180 top
R38  45.4,54.61 0 top
R39  34.61,80.96 0 top
R40  51.12,55.24 270 top
R41  58.1,57.15 0 top
R42  58.1,54.61 0 top
R43  51.59,20 180 top
R44  18.57,42.07 270 top
R45  34.61,65.72 0 top
R46  21.27,69.37 270 top
R47  21.27,64.29 270 top
R48  21.27,59.21 270 top
R49  21.27,54.13 270 top
R50  60.64,40.32 270 top
R51  47.31,65.72 0 top
R52  60.01,65.72 0 top
R53  72.71,65.72 0 top
R54  63.82,55.24 270 top
R55  70.8,57.15 0 top
R56  70.8,54.61 0 top
R57  47.31,63.18 0 top
R58  47.31,68.26 0 top
R59  47.31,70.8 0 top
R60  60.01,63.18 0 top
R61  60.01,68.26 0 top
R62  60.01,70.8 0 top
R63  72.71,63.18 0 top
R64  72.71,68.26 0 top
R65  72.71,70.8 0 top
R66  3.81,11.27 0 top
R67  28.26,30.96 90 top
R68  7.46,9.53 90 top
T1  46.51,7.46 270 top
U1  66.36,36.83 180 top
X1  29.37,18.89 180 top
XO1  49.05,36.2 180 top

### Tracks (layer width: path | path; a pad name or v marks a point on that pad's centre or on a via)
12V_ESTOP
  Top 0.152: R9.1 26.04,22.54 23.34,19.84 23.34,3.81 22.07,2.54 J5.A1 | LED1.A 7.46,4.92 7.78,4.6
  Top 0.61: J5.A1 J5.A2 D1.C 12.38,2.38 10.16,4.6 7.78,4.6 7,4.6 4.92,6.67 4.28,7.31 Q2.3
!CS_E  (via drill 0.3)
  Top 0.152: v31.43,7.62 32.25,6.8 IC5.9 | v34.13,18.41 34.13,20.16 30.8,23.5 30.8,33.5 31.22,33.92 IC3.14
  Bottom 0.152: v34.13,18.41 34.13,17.46 31.91,15.24 31.91,8.1 v31.43,7.62
!CS_L
  Top 0.152: IC3.24 38.48,30.07 36.99,28.57 36.99,17.94 38.26,16.67 48.58,16.67 49.53,17.62 49.53,20.48 50.01,20.95 55.24,20.95 56.99,22.7 56.99,24.61 58.26,25.88 58.26,27.89 U1.P$16
!INT_E  (via drill 0.3)
  Top 0.152: IC5.4 29,6.08 v29.21,6.35 | v33.5,18.89 33.5,20.32 30.48,23.34 30.48,33.66 31.25,34.42 IC3.13
  Bottom 0.152: v29.21,6.35 31.59,8.73 31.59,15.4 33.5,17.3 v33.5,18.89
!MCLR  (via drill 0.3)
  Top 0.152: IC3.7 31.79,37.42 v31.75,37.47 | v29.21,37.47 28.73,37.47 26.55,39.65 E1.4
  Bottom 0.152: v31.75,37.47 v29.21,37.47
!MCLRI  (via drill 0.3)
  Top 0.152: R44.1 18.99,43.34 J8.1 24.46,40.31 E1.5 23.69,39.65 v23.65,39.69 | J18.10 v44.77,22.7
  Bottom 0.152: v44.77,22.7 35.08,22.7 26.67,31.11 26.67,38.1 25.08,39.69 v23.65,39.69
+3V3  (via drill 0.3)
  Top 0.152: J8.2 18.99,40.8 R44.2 17.62,42.17 17.62,43.66 18.1,44.13 18.73,44.13 19.37,44.77 19.37,50.16 18.05,51.48 LED2.A | R39.2 44.45,80.96 45.56,82.07 47.05,82.07 R22.2 57.15,80.96 58.26,82.07 59.75,82.07 R25.2 69.75,80.96 R27.2
  Top 0.203: T1.2 40.58,10.64 R16.2 R15.2
  Top 0.254: 43.36,35.42 v43.34,35.4 | R27.2 74.45,76.26 74.61,76.04 76.99,73.66 76.99,35.51 U1.P$3 | v39.53,29.53 39.53,28.89 38.26,27.62 38.26,19.49 J18.1
  Top 0.305: v38.89,43.5 38.48,43.09 IC3.57 38.48,41.5 37.47,40.48 | IC3.38 43.36,35.42 | v45.72,33.81 45.45,33.92 IC3.35 43.71,33.92 42.55,35.08 41.75,35.08 41.67,35 | v36.04,29.84 35.98,29.9 IC3.19 35.98,33.29 36.35,33.66 | v39.53,29.53 39.48,29.89 IC3.26 39.48,33.61 39.53,33.66 | 35.24,35.72 34.13,35.72 33.93,35.92 IC3.10 31.86,35.92 v31.75,36.04 31.59,36.04 26.83,40.8 v24.77,40.8 | v43.34,35.4 v42.07,35.4 | IC1.4 69.03,35.06 69.37,35.4
  Top 0.406: C22.1 25.96,11.09 IC5.28 26.99,11.15 26.99,12.06 27.3,12.38 27.62,12.38 28.31,13.07 C24.1 29,12.49 IC5.25 29,9.89 29.37,9.53 31.91,9.53 | IC5.20 32.25,12.94 C23.1 | IC5.19 IC5.20 | R15.2 C21.1 36.64,11.09 IC5.15 35.63,10.95 v36.2,10.95 | C20.1 32.9,2.63 IC5.10 32.9,8.26 | 31.91,9.53 32.23,9.84 32.23,11.06 IC5.20 | 32.9,8.26 32.9,8.54 31.91,9.53 | v34.61,9.37 33.5,8.26 32.9,8.26 | R18.1 26.09,56.09 v26.19,55.88 | R33.1 38.68,56.09 v38.89,55.88 36.83,55.88 35.88,54.93 35.88,44.45 v36.51,43.81 | R40.1 51.38,56.09 v51.59,55.88 | R54.1 64.08,56.09 v64.29,55.88
  Top 0.61: C23.1 32.07,13.18 32.07,14.13 33.66,15.72 35.24,15.72 36.51,14.45 56.36,14.45 58.58,16.67 58.58,23.81 61.28,26.51 67.63,26.51 69.69,28.57 69.69,29.9 C2.1 | U1.P$3 70.22,33.02 69.59,33.5 | XO1.4 51.73,35.37 C14.1 v51.75,35.4
  Top 0.813: 37.47,40.48 37.15,40.48 35.24,38.58 35.24,35.72 35.24,34.77 36.35,33.66 39.53,33.66 40.32,33.66 41.67,35 v42.07,35.4 | v69.37,33.34 69.37,35.4
  Top 1.016: C2.1 69.59,33.41 | 69.59,33.5 69.59,33.41 | 69.59,33.41 IC1.4
  Bottom 0.254: v38.89,43.5 38.89,43.24 C13.1 | 32.01,35.88 C11.1 | v43.34,35.4 42.92,35.08 C5.1 | 44.19,33.81 C3.1
  Bottom 0.305: v31.75,36.04 32.01,35.88 | v45.72,33.81 44.19,33.81 | C10.1 v36.04,29.84 | v39.53,29.53 39.53,30.9 C12.1 | J8.2 v24.77,40.8 | v38.89,43.5 38.58,43.81 v36.51,43.81
  Bottom 0.406: v36.2,10.95 v34.61,9.37 | v26.19,55.88 v38.89,55.88 v51.59,55.88 v64.29,55.88 64.93,55.88
  Bottom 0.813: v42.07,35.4 v51.75,35.4 55.4,31.75 67.79,31.75 v69.37,33.34
+5V  (via drill 0.3)
  Top 0.152: R1.2 16.99,35.24 17.3,35.56 17.3,39.82 C4.1 14.73,42.36 16.83,44.45 18.57,44.45 19.05,44.93 19.05,48.53 LED3.A
  Top 0.406: 73.34,65.72 v73.5,65.72 R53.2 | 35.62,65.72 v35.56,65.72 R45.2 35.4,65.72 | 48.32,65.72 v48.26,65.72 R51.2 48.1,65.72 | 61.02,65.72 v60.96,65.72 R52.2 60.8,65.72
  Top 1.016: 6.99,42.39 7.14,42.23 | C1.1 63.13,31.75 IC1.3 64.06,32.15 65.09,33.18 v65.09,38.1
  Top 1.27: 5.08,41.91 4.92,42.07 F1.2A F1.2B 4.94,45.15 D3.C
  Bottom 0.406: 34.29,64.45 26.67,64.45 19.53,57.31 9.3,57.31 F1.2B | 34.29,64.45 46.99,64.45 | 59.69,64.45 72.23,64.45 v73.5,65.72 | 34.29,64.45 v35.56,65.72 | 46.99,64.45 v48.26,65.72 | 59.69,64.45 v60.96,65.72 | 59.69,64.45 46.99,64.45
  Bottom 1.016: v65.09,38.1 65.09,46.67 63.5,48.26 9.53,48.26 5.02,52.93 F1.2B
  pour Top (no thermals): 3.49,40.01 3.02,40.48 3.02,42.7 3.49,43.18 15.56,43.18 15.88,42.86 15.88,41.75 15.4,41.27 7.3,41.27 6.03,40.01
+12V
  Top 0.152: LED4.A 17.94,47.62 | 17.88,47.62 17.94,47.62 | 17.94,47.62 18.73,46.83 18.73,45.09 18.41,44.77 12.54,44.77 9.21,48.1 9.21,53.5 7.46,55.24 2.54,55.24 1.11,53.82 1.11,34.13 2.54,32.7 8.26,32.7
  Top 0.203: IC2.5 12.86,36.2 11.91,35.24 IC2.3
  Top 1.016: D2.C 14.49,29.19 F2.2A
  Top 1.27: F2.2B F2.2A | F2.2A 12.54,27.33 12.38,27.3 9.39,30.29 C30.1 | F2.2A F3.2A F3.2B
  pour Top (isolate 0.254, no thermals): 10.16,29.84 7.94,29.84 7.62,30.16 7.62,33.18 9.84,35.4 10.95,35.4 11.11,35.24 11.11,34.92 10.48,34.29 10.48,30.16
ESTOP_ENG  (via drill 0.3)
  Top 0.152: Q1.1 27.84,30.01 R67.1 28.52,30.11 v28.57,30.16 | IC3.42 41.55,37.42 40.01,35.88 40.01,35.4 39.69,35.08 39.05,35.08 38.73,35.4 v38.73,36.35
  Bottom 0.152: v28.57,30.16 28.1,30.16 26.99,31.27 26.99,38.1 28.73,39.85 35.56,39.85 38.73,36.67 | v38.73,36.35 38.73,36.67 | 38.73,36.67 38.66,36.59
ESTOP_SNS
  Top 0.152: R9.2 R10.1 28.26,24.92 30.16,26.83 30.16,33.81 31.27,34.92 IC3.12
GND  (via drill 0.3)
  Top 0.254: 38.98,41.02 39.05,40.96 | IC3.9 34.22,36.42 v34.29,36.51 | 45.65,36.92 45.72,36.99
  Top 0.305: IC3.56 38.98,41.02 | IC3.20 36.48,32.2 36.51,32.23 | 38.89,32.23 38.89,32.07 38.98,32 IC3.25 38.98,29.91 38.42,29.37 | 45.65,36.92 IC3.41 | IC3.41 43.56,36.92 v43.18,36.83 | IC3.41 43.3,36.92 43.18,36.89
  Top 0.406: IC5.11 33.55,1.91 C20.2
  other vias: 21.75,8.57 29.84,8.57 30.32,14.92 29.53,16.67 33.66,9.53 34.92,13.18 33.81,14.61 34.29,7.62 37.94,8.26 37.47,6.03 30,2.22 28.57,1.11 35.24,1.43 37.62,1.43 42.07,1.43 28.57,1.91 23.97,10 24.13,12.54 25.88,13.02 24.29,14.61 25.72,16.51 24.45,8.41 27.62,5.56 16.35,19.21 23.81,22.86 12.22,33.02 11.59,37.15 75.09,31.75 57.15,26.35 65.56,27.62 65.09,24.77 67.79,44.45 62.39,60.8 67.15,50.16 69.85,62.23 23.34,71.75 52.7,7.46 47.78,5.08 48.26,8.26 55.09,7.3 56.2,10.16 58.26,11.43 57.63,7.62 63.02,6.99 62.71,4.6 50.96,1.43 55.4,1.27 52.86,13.02 64.29,13.65 66.2,16.51 70.96,8.89 75.25,10.16 63.66,22.7 53.98,23.18 51.28,31.91 56.2,20 75.72,77.95 70.8,66.99 69.37,69.22 70.33,81.28 60.96,83.82 62.87,40.48 70.17,52.86 75.88,44.61 7.78,59.21 6.03,59.85 38.26,13.34 12.06,39.85 10.32,39.85 13.02,38.1 33.5,12.22 12.22,33.66 62.87,42.07 41.43,60.33 37.47,83.03 10.95,71.44 18.41,83.98 35.56,74.14 37.31,67.31 30.64,66.99 43.97,66.99 56.04,60.17 63.5,67.63 60.8,69.37 59.21,72.87 49.85,72.71 14.92,33.02 16.19,39.53 14.45,39.85 12.7,39.85 15.08,39.85 9.68,39.85 46.2,18.73 47.62,74.61 33.34,83.5 48.26,84.14 69.69,82.39 68.26,24.61 46.35,10.32 29.53,20 28.42,20 24.13,19.53 22.54,19.05 33.97,21.59 6.83,39.21 3.65,38.58 12.54,45.72 23.97,25.56 12.22,31.43 12.22,30.8 18.26,39.21 18.26,38.1 18.26,35.88 18.26,34.92 16.19,31.11 75.25,49.69 3.17,58.1 8.73,11.75 7.94,24.45 44.45,2.38 23.97,75.41 10.79,37.94 6.03,30.96 0.95,30 7.78,27.15 3.02,22.23 11.59,50.64 30.48,36.04 38.89,40.96 49.37,32.07 50.32,33.5 47.94,39.05 42.55,34.13 36.99,32.54 40.16,32.7 38.73,29.21 20.16,44.77 16.83,42.86 10.16,66.99 11.75,67.63 14.45,75.41 12.06,73.66 18.89,76.68 5.56,77.31 6.67,79.06 37.47,78.26 34.29,34.77 34.45,33.5 36.99,36.2 33.81,41.59 44.29,41.59 25.08,37.94 25.56,36.2 75.88,73.5 39.21,24.45 38.58,17.94 31.59,16.99 45.72,37.15 20.95,49.69 24.77,51.91 31.59,50.96 37.31,51.75 44.45,52.55 38.26,47.15 46.99,46.99 51.28,51.75 57.94,52.39 52.39,45.72 63.02,51.44 61.91,44.77 72.71,47.94 32.86,43.5 28.89,46.99 21.75,46.2 20,52.07 29.53,60.33 11.11,55.56 25.4,66.2 50.16,66.52 51.12,78.58 63.34,78.9 70.01,78.42 38.26,32.54 38.1,34.77 43.02,38.26 39.37,38.73 19.84,31.59 33.81,28.73 42.39,33.5 42.07,36.51 39.69,28.1 42.55,28.89 43.02,26.04 43.81,23.97 2.06,16.99 1.27,7.78 16.35,5.56 24.77,4.45 48.74,49.37 49.53,51.12 39.85,49.53 48.58,33.66 51.59,37.78 47.15,36.99
  pour Bottom (isolate 0.254): 0,84.77 78.26,84.61 78.26,0.16 0,0.32
  pour Top (isolate 0.254, rank 6): 78.26,84.61 0,84.77 0,0.32 78.26,0.16
  pour Top (isolate 0.254, rank 4, no thermals): 7.78,30.8 7.78,40.01 8.41,40.64 15.72,40.64 16.67,39.69 16.67,32.86 12.86,29.69 8.89,29.69
GPIO_0
  Top 0.152: IC3.4 30.77,38.92 26.99,42.7 26.99,45.09 23.18,48.9 23.18,66.62 R46.2
GPIO_1
  Top 0.152: IC3.5 30.79,38.42 26.67,42.55 26.67,44.93 22.86,48.74 22.86,61.86 R47.2
GPIO_2
  Top 0.152: R48.2 22.54,57.09 22.54,48.58 26.35,44.77 26.35,42.39 30.66,38.08 32.09,38.08 32.23,37.94 33.02,37.94 IC3.6
GPIO_3
  Top 0.152: IC3.8 31.34,36.92 26.04,42.23 26.04,44.61 22.23,48.42 22.23,52.33 R49.2
M1FB
  Top 0.152: IC3.3 31.06,39.42 29.84,40.64 29.84,43.66 34.13,47.94 34.13,54.03 R20.2
M1RC
  Top 0.152: IC3.2 31.04,39.92 30.16,40.8 30.16,43.5 34.45,47.78 34.45,56.25 R19.2
M2FB
  Top 0.152: IC3.60 36.98,43.34 46.83,53.18 46.83,54.03 R38.2
M2RC
  Top 0.152: IC3.59 37.48,43.36 47.15,53.02 47.15,56.25 R34.2
M3FB
  Top 0.152: IC3.48 45.18,40.42 45.56,40.8 45.56,43.97 51.59,50.01 57.78,50.01 59.37,51.59 59.37,54.13 58.95,54.55 R42.2
M3RC
  Top 0.152: IC3.47 45.16,39.92 45.88,40.64 45.88,43.81 51.75,49.69 57.94,49.69 59.69,51.44 59.69,56.36 58.9,57.15 R41.2
M4FB
  Top 0.152: IC3.46 45.14,39.42 46.2,40.48 46.2,43.66 51.91,49.37 68.58,49.37 72.23,53.02 72.23,54.03 R56.2
M4RC
  Top 0.152: IC3.45 45.11,38.92 46.51,40.32 46.51,43.5 52.07,49.05 68.74,49.05 72.55,52.86 72.55,56.25 R55.2
MISO  (via drill 0.3)
  Top 0.152: IC5.6 30.3,6.01 v30.32,6.03 | IC3.18 35.48,29.29 35.72,29.05 35.72,17.78 v35.4,17.46 35.4,16.83 36.83,15.4 55.88,15.4 57.63,17.14 57.63,24.29 60.33,26.99 60.33,30.8 58.21,32.91 U1.P$14
  Bottom 0.152: v30.32,6.03 31.59,6.03 32.54,6.99 32.54,14.92 35.08,17.46 v35.4,17.46
MOSI  (via drill 0.3)
  Top 0.152: v30.95,5.41 IC5.7 | IC3.21 36.99,30 36.04,29.05 v36.04,16.99 37.31,15.72 55.72,15.72 57.31,17.3 57.31,24.45 60.01,27.15 60.01,28.57 58.21,30.38 U1.P$15
  Top 0.203: v30.96,5.4 v30.95,5.41
  Bottom 0.152: v30.96,5.4 31.27,5.71 31.75,5.71 32.86,6.83 32.86,14.76 34.92,16.83 35.88,16.83 v36.04,16.99
N$1
  Top 0.152: R20.1 J6.2 25.93,54.61 R18.2
N$2
  Top 0.152: IC2.4 14.5,35.24 R2.2 15.29,34.82 R1.1
N$3  (via drill 0.3)
  Top 0.406: C8.2 16.25,37.05 15.62,36.41 arc-45 14.71,36.04 v14.13,36.04 | v11.91,36.2 IC2.2
  Bottom 0.406: v14.13,36.04 12.06,36.04 v11.91,36.2
  pour Top (isolate 0.254, rank 2, no thermals): 3.65,33.5 3.17,33.97 3.17,36.51 3.65,36.99 9.37,36.99 9.84,36.51 10.48,36.51 10.48,35.88 9.37,35.88 6.99,33.5
N$4
  Top 1.27: F1.1B F1.1A 15.88,79.63 J1.2
N$5
  Top 0.406: IC2.6 C8.1
N$6
  Top 0.203: LED2.C R5.1
N$7
  Top 0.203: LED3.C R6.1
N$8
  Top 0.203: LED4.C R4.1
N$9
  Top 0.203: LED5.C R7.1
N$10
  Top 0.152: J6.3 R19.1
N$11
  Top 0.203: R12.2 LED6.A
N$12
  Top 0.152: R24.1 46.46,79.69 | 46.46,79.69 R22.1 | J20.2 46.46,79.69
N$13
  Top 1.27: J3.3 3.33,25.88 17.46,11.75 20.32,11.65 F3.1B F3.1A
N$14
  Top 0.203: T1.1 41.33,11.91 R15.1 39.31,12.22 36.04,12.22 35.88,12.38 34.61,12.38 34.2,11.97 IC5.17
N$15
  Top 0.203: T1.3 41.01,9.37 R16.1 39.9,8.52 38.26,10.16 36.35,10.16 35.88,9.68 35.24,9.68 34.85,10.08 IC5.16
N$16
  Top 0.203: T1.6 41.01,5.56 R17.1 39.79,5.4 35.24,5.4 34.85,5 IC5.13
N$17
  Top 0.203: T1.8 40.58,1.53 R14.1 40.38,1.53 39.53,2.38 34.77,2.38 34.2,2.95 IC5.12
N$18
  Top 0.305: IC5.1 27.05,2.02 C16.1
N$19  (via drill 0.3)
  Top 0.152: IC5.27 27.7,9.61 v27.78,9.53 | v60.17,20 R11.1
  Bottom 0.152: v27.78,9.53 27.78,9.05 26.51,7.78 26.51,4.45 27.78,3.17 32.7,3.17 36.35,6.83 49.85,6.83 60.17,17.14 60.48,17.14 60.96,17.62 60.96,19.21 v60.17,20
N$20  (via drill 0.3)
  Top 0.152: IC5.26 28.35,9.59 v28.57,9.37 | v60.33,17.78 R12.1
  Bottom 0.152: v28.57,9.37 26.83,7.62 26.83,4.6 27.94,3.49 32.54,3.49 36.2,7.14 49.69,7.14 v60.33,17.78
N$21
  Top 0.203: T1.16 56.36,11.91 J7.1
N$22
  Top 0.203: J7.5 64.61,10 J7.4 62.6,12.01 R31.1
N$23
  Top 0.203: IC5.24 29.69,11.12 29.69,13.34 28.89,14.13 27.78,14.13 27.2,14.71 C18.1 27.2,18.64 X1.2
N$24
  Top 0.203: IC5.23 30.32,13.34 28.89,14.76 C17.1 28.68,16.93 30.64,18.89 X1.1
N$25
  Top 0.203: R13.1 36.1,3.23 IC5.14
N$26
  Top 0.152: R21.1 33.76,79.69 | 33.76,79.69 R39.1 | J2.2 33.76,79.69
N$27
  Top 0.152: R26.1 59.16,79.69 | 59.16,79.69 R25.1 | J21.2 59.16,79.69
N$28
  Top 0.203: LED7.A R11.2
N$29
  Top 0.203: J7.7 67.15,10 J7.8 67.68,12.01 R32.1
N$30
  Top 0.152: R28.1 71.86,75.88 | 71.86,75.88 R27.1 | J22.2 70.8,75.88 71.86,75.88
N$31
  Top 0.152: R38.1 J9.2 38.63,54.61 R33.2
N$32
  Top 0.152: J9.3 R34.1
N$33
  Top 0.203: R17.2 R14.2 C19.1
N$34
  Top 0.203: T1.14 57.31,9.37 59.05,7.62 60.01,7.62 60.8,8.41 J7.2
N$35
  Top 0.203: T1.11 56.67,5.56 57.47,6.35 59.69,6.35 J7.3
N$36
  Top 0.203: T1.9 51.59,3.02 51.91,3.33 55.09,3.33 57.63,5.87 63.98,5.87 65.88,7.78 J7.6
N$37
  Top 0.152: R42.1 J10.2 51.33,54.61 R40.2
N$38
  Top 0.203: T1.15 R29.1
N$39  (via drill 0.3)
  Top 0.305: C34.1 v53.82,2.38 | v53.82,4.29 R30.2 | R29.2 54.29,10.58 v54.29,10 | v58.74,14.45 R31.2 60.59,14.55 61.44,15.4 65.03,15.4 R32.2
  Bottom 0.305: v53.82,2.38 v53.82,4.29 53.82,9.53 v54.29,10 54.29,10.64 58.1,14.45 v58.74,14.45
N$40
  Top 0.152: J10.3 R41.1
N$41
  Top 0.152: R56.1 J11.2 64.03,54.61 R54.2
N$42
  Top 0.152: J11.3 R55.1
N$43
  Top 0.152: IC3.39 47.42,35.92 47.94,35.4 47.97,35.4 XO1.3
N$45
  Top 1.27: F2.1A F2.1B 12.54,14.45 6.99,20 J4.2
N$46
  Top 0.152: J8.5 23.5,35.24 23.5,37.49 E1.8
N$47
  Top 0.152: J8.4 22.7,35.72 23.18,36.2 23.18,37.62 23.81,38.26 23.81,38.58 24.09,38.85 E1.7
N$48  (via drill 0.3)
  Top 0.254: v46.83,31.59 46.75,31.67
  Top 0.305: IC3.34 45.16,33.42 46.75,31.83 46.75,31.67 47.44,31.3 J13.1
  Bottom 0.254: C25.1 46.99,31.75 v46.83,31.59
N$49
  Top 0.152: IC3.36 45.91,34.42 48.1,32.23 48.1,30.43 J13.2
N$50
  Top 0.152: IC3.37 45.88,34.92 48.74,32.07 J13.3
N$51
  Top 0.152: J14.5 R23.1
N$52
  Top 0.152: J14.3 R35.1
N$53
  Top 0.152: J14.2 R36.1
N$54
  Top 0.152: J15.5 R57.1
N$55
  Top 0.152: J15.3 R58.1
N$56
  Top 0.203: T1.10 R30.1
N$57
  Top 0.152: J15.2 R59.1
N$58
  Top 0.152: J16.5 R60.1
N$59
  Top 0.152: R61.1 J16.3
N$60
  Top 0.152: J16.2 R62.1
N$61
  Top 0.152: J17.5 R63.1
N$62
  Top 0.152: R64.1 J17.3
N$63
  Top 0.152: J17.2 R65.1
N$64
  Top 0.406: J15.4 R51.1
N$65
  Top 0.406: J14.4 R45.1
N$66
  Top 1.27: J12.1 73.03,26.46 arc-90 U1.P$1
N$67
  Top 0.152: U1.P$12 59.27,38.1 R50.2
N$68
  Top 0.406: J16.4 R52.1
N$69
  Top 0.152: R37.1 LED8.A
N$70
  Top 0.152: R43.1 LED9.A
N$71
  Top 0.406: J17.4 R53.1
N$72  (via drill 0.3)
  Top 0.152: Q2.1 4.76,11.17 R66.2 4.66,12.01 v4.6,12.06 | v23.34,30.96 Q1.3
  Bottom 0.152: v4.6,12.06 7.3,12.06 16.19,20.95 16.19,28.57 18.57,30.96 v23.34,30.96
N$73
  Top 1.016: C28.1 16,62.42 16.19,62.23
  Top 1.27: J27.2 J26.2 | J26.2 16.19,60.64 | J26.2 16.19,62.23 J25.2 J24.2 16.19,73.53 C29.1 FB1.2
N$74
  Top 0.61: Q2.2 2.86,11.11 | 2.86,11.11 2.86,13.34 J4.1 | R66.1 2.96,11.21 2.86,11.11
N$75
  Top 0.152: LED1.C R68.1
N$76
  Top 0.152: J27.3 18.79,54.98 R49.1
N$77
  Top 0.152: J26.3 18.79,60.06 R48.1
N$78
  Top 0.152: J25.3 18.79,65.14 R47.1
N$79
  Top 0.152: 21.27,70.17 R46.1 18.79,70.22 J24.3
PGC  (via drill 0.3)
  Top 0.152: IC3.16 31.81,32.92 v31.43,32.54 | v29.21,34.45 29.21,36.04 26.79,38.45 E1.1
  Bottom 0.152: v31.43,32.54 31.11,32.54 v29.21,34.45
PGD  (via drill 0.3)
  Top 0.152: IC3.15 31.52,33.42 v31.43,33.34 | v29.84,34.92 29.84,35.88 26.87,38.85 E1.2
  Bottom 0.152: v31.43,33.34 v29.84,34.92
QEA_1
  Top 0.152: IC3.62 35.98,43.07 35.08,43.97 35.08,58.9 36.2,60.01 36.2,67.53 R35.2
QEA_2
  Top 0.152: IC3.55 39.48,44.41 47.78,52.7 47.78,59.21 48.9,60.33 48.9,67.53 R58.2
QEA_3
  Top 0.152: IC3.52 40.98,44.48 48.74,52.23 48.74,58.74 51.12,61.12 60.48,61.12 61.75,62.39 61.75,67.37 R61.2
QEA_4
  Top 0.152: IC3.44 45.09,38.42 46.83,40.16 46.83,43.34 52.23,48.74 68.9,48.74 72.87,52.7 72.87,60.33 74.3,61.75 74.3,67.53 R64.2
QEB_1
  Top 0.152: IC3.63 35.48,43.1 34.77,43.81 34.77,59.05 35.88,60.17 35.88,62.76 R23.2
QEB_2
  Top 0.152: IC3.58 37.98,43.38 47.47,52.86 47.47,59.37 48.58,60.48 48.58,62.76 R57.2
QEB_3
  Top 0.152: IC3.53 40.48,44.45 48.42,52.39 48.42,58.9 50.96,61.44 60.33,61.44 61.28,62.39 61.28,62.87 R60.2
QEB_4  (via drill 0.3)
  Top 0.152: IC3.50 41.98,44.52 47.78,50.32 57.15,50.32 v57.47,50.64 | R63.2 73.82,63.02 73.98,62.87 73.98,61.91 72.87,60.8 64.45,60.8 60.01,56.36 60.01,51.28 59.05,50.32 v59.05,50.01
  Bottom 0.152: v57.47,50.64 58.1,50.01 v59.05,50.01
QEI_1
  Top 0.152: IC3.61 36.48,43.05 35.4,44.13 35.4,58.74 36.51,59.85 36.51,69.75 R36.2
QEI_2
  Top 0.152: IC3.54 39.98,44.43 48.1,52.55 48.1,59.05 49.21,60.17 49.21,69.75 R59.2
QEI_3
  Top 0.152: IC3.51 41.48,44.5 49.05,52.07 49.05,58.58 51.28,60.8 60.64,60.8 62.07,62.23 62.07,69.59 R62.2
QEI_4
  Top 0.152: IC3.43 45.06,37.92 47.15,40.01 47.15,43.18 52.39,48.42 69.06,48.42 73.18,52.55 73.18,60.17 74.61,61.59 74.61,69.75 R65.2
RX_DONE  (via drill 0.3)
  Top 0.152: IC3.40 45.79,36.42 46.35,36.99 46.35,38.73 47.47,39.85 47.47,43.02 52.55,48.1 53.82,48.1 v54.77,47.15 | v60.64,46.51 60.96,46.83 68.32,46.83 U1.P$6
  Bottom 0.152: v54.77,47.15 60.01,47.15 v60.64,46.51
RX_SW  (via drill 0.3)
  Top 0.152: U1.P$4 74.45,35.56 70.96,39.05 62.71,39.05 60.17,36.51 57.15,36.51 55.56,34.92 55.56,28.26 52.23,24.92 45.24,24.92 43.18,26.99 43.18,29.21 v42.55,29.84 | v41.43,29.84 40.32,29.84 39.98,30.18 IC3.27
  Bottom 0.152: v42.55,29.84 v41.43,29.84
SCK  (via drill 0.3)
  Top 0.152: v31.27,6.67 31.6,6.34 IC5.8 | IC3.17 34.98,29.31 35.4,28.89 35.4,18.57 v34.77,17.94 34.77,16.99 36.67,15.08 56.04,15.08 57.94,16.99 57.94,24.13 60.64,26.83 60.64,33.02 58.21,35.45 U1.P$13
  Bottom 0.152: v34.77,17.94 34.77,17.62 32.23,15.08 32.23,7.46 31.43,6.67
  Bottom 0.203: 31.43,6.67 v31.27,6.67
STAT1
  Top 0.152: R37.2 50.64,17.78 48.9,16.03 37.94,16.03 36.35,17.62 36.35,28.89 37.48,30.02 IC3.22
STAT2
  Top 0.152: IC3.23 37.98,30.05 36.67,28.73 36.67,17.78 38.1,16.35 48.74,16.35 49.85,17.46 49.85,19.11 R43.2
TCK  (via drill 0.3)
  Top 0.152: E2.3 41.71,25.28 41.27,25.72 41.27,28.1 v40.96,28.42 | v33.97,40.48 33.91,40.42 IC3.1
  Bottom 0.152: v40.96,28.42 40.8,28.57 40.8,29.21 40.48,29.53 40.48,31.75 41.12,32.38 41.12,34.77 35.72,40.16 34.29,40.16 v33.97,40.48
TCKI
  Top 0.152: E2.6 41.71,23.14 40.96,22.38 J18.4
TDI
  Top 0.152: IC3.31 41.98,25.96 42.51,25.43 E2.1
TDII
  Top 0.152: E2.8 42.51,23.37 43.5,22.38 J18.8
TDO  (via drill 0.3)
  Top 0.152: E2.2 42.11,25.36 41.59,25.88 41.59,28.73 v41.43,29.05 | v35.56,40.8 34.98,41.37 IC3.64
  Bottom 0.152: v41.43,29.05 40.8,29.69 40.8,31.59 41.43,32.23 41.43,34.92 v35.56,40.8
TDOI
  Top 0.152: E2.7 42.11,21.74 J18.6
TH1
  Top 0.152: R21.2 37.68,76.2 66.99,76.2 70.96,72.23 74.3,72.23 74.93,71.6 74.93,61.44 73.5,60.01 73.5,52.39 69.22,48.1 56.67,48.1 53.98,45.4 53.98,29.05 51.44,26.51 46.04,26.51 44.77,27.78 44.77,32.59 IC3.33
TH2
  Top 0.152: R24.2 50.06,76.52 67.15,76.52 71.12,72.55 74.45,72.55 75.25,71.75 75.25,61.28 73.82,59.85 73.82,52.23 69.37,47.78 56.83,47.78 54.29,45.24 54.29,28.89 51.59,26.19 45.88,26.19 44.45,27.62 44.45,31.43 43.18,32.7 41.43,32.7 40.48,31.75 IC3.28
TH3
  Top 0.152: R26.2 62.45,76.83 67.31,76.83 71.28,72.87 74.61,72.87 75.56,71.91 75.56,61.12 74.14,59.69 74.14,52.07 69.53,47.47 56.99,47.47 54.61,45.09 54.61,28.73 51.75,25.88 45.72,25.88 44.13,27.46 44.13,31.27 43.02,32.38 41.59,32.38 40.98,31.78 IC3.29
TH4
  Top 0.152: R28.2 73.56,74.4 75.88,72.07 75.88,60.96 74.45,59.53 74.45,51.91 69.69,47.15 57.15,47.15 54.93,44.93 54.93,28.57 51.91,25.56 45.56,25.56 43.81,27.3 43.81,31.11 42.86,32.07 41.75,32.07 41.48,31.8 IC3.30
TMS  (via drill 0.3)
  Top 0.152: E2.4 41.31,25.21 40.96,25.56 40.96,27.3 v40.48,27.78 | v39.37,35.72 42.48,38.83 IC3.49
  Bottom 0.152: v40.48,27.78 40.32,27.94 40.32,29.21 40.16,29.37 40.16,31.91 40.8,32.54 40.8,34.61 39.69,35.72 v39.37,35.72
TMSI
  Top 0.152: E2.5 41.31,23.37 40.96,23.02 40.32,23.02 39.69,22.38 J18.2
TX_SW
  Top 0.152: U1.P$5 72.55,38.1 71.12,39.53 62.71,39.53 60.01,36.83 56.99,36.83 55.24,35.08 55.24,28.42 52.07,25.24 45.4,25.24 43.5,27.15 43.5,30 42.55,30.96 42.5,30.96 IC3.32
V+
  Top 0.152: R3.1 26.04,28.1 25.08,27.15 25.08,22.07 23.02,20 10.79,20 5.71,25.08 5.71,30 4.29,31.43 J3.1 0.79,33.97 0.79,53.98 2.38,55.56 7.62,55.56 9.53,53.66 9.53,48.26 11.11,46.67 17.1,46.67 LED5.A
VBAT_SNS
  Top 0.152: R3.2 R8.1 29.31,26.45 29.84,26.99 29.84,33.97 31.29,35.42 IC3.11
VCCIO
  Top 1.27: J1.3 20.95,75.56 21.5,75.02 FB1.1

### Text on the board
tPlace: THERM | 1 | 2 | 3 | 4 | COUCH | ENC | - / B / A / + / I | 3V3 | PWM | S / +/F / - | 5V | 12V | INT Board rC | B+ | LORA | ICSP | W.A. 7/17 | PWR | ESTOP | JTAG | ANT